# EAGLE board electrosteel2020_10_arrange2 (EAGLE 9.2.2), part 1 of 4
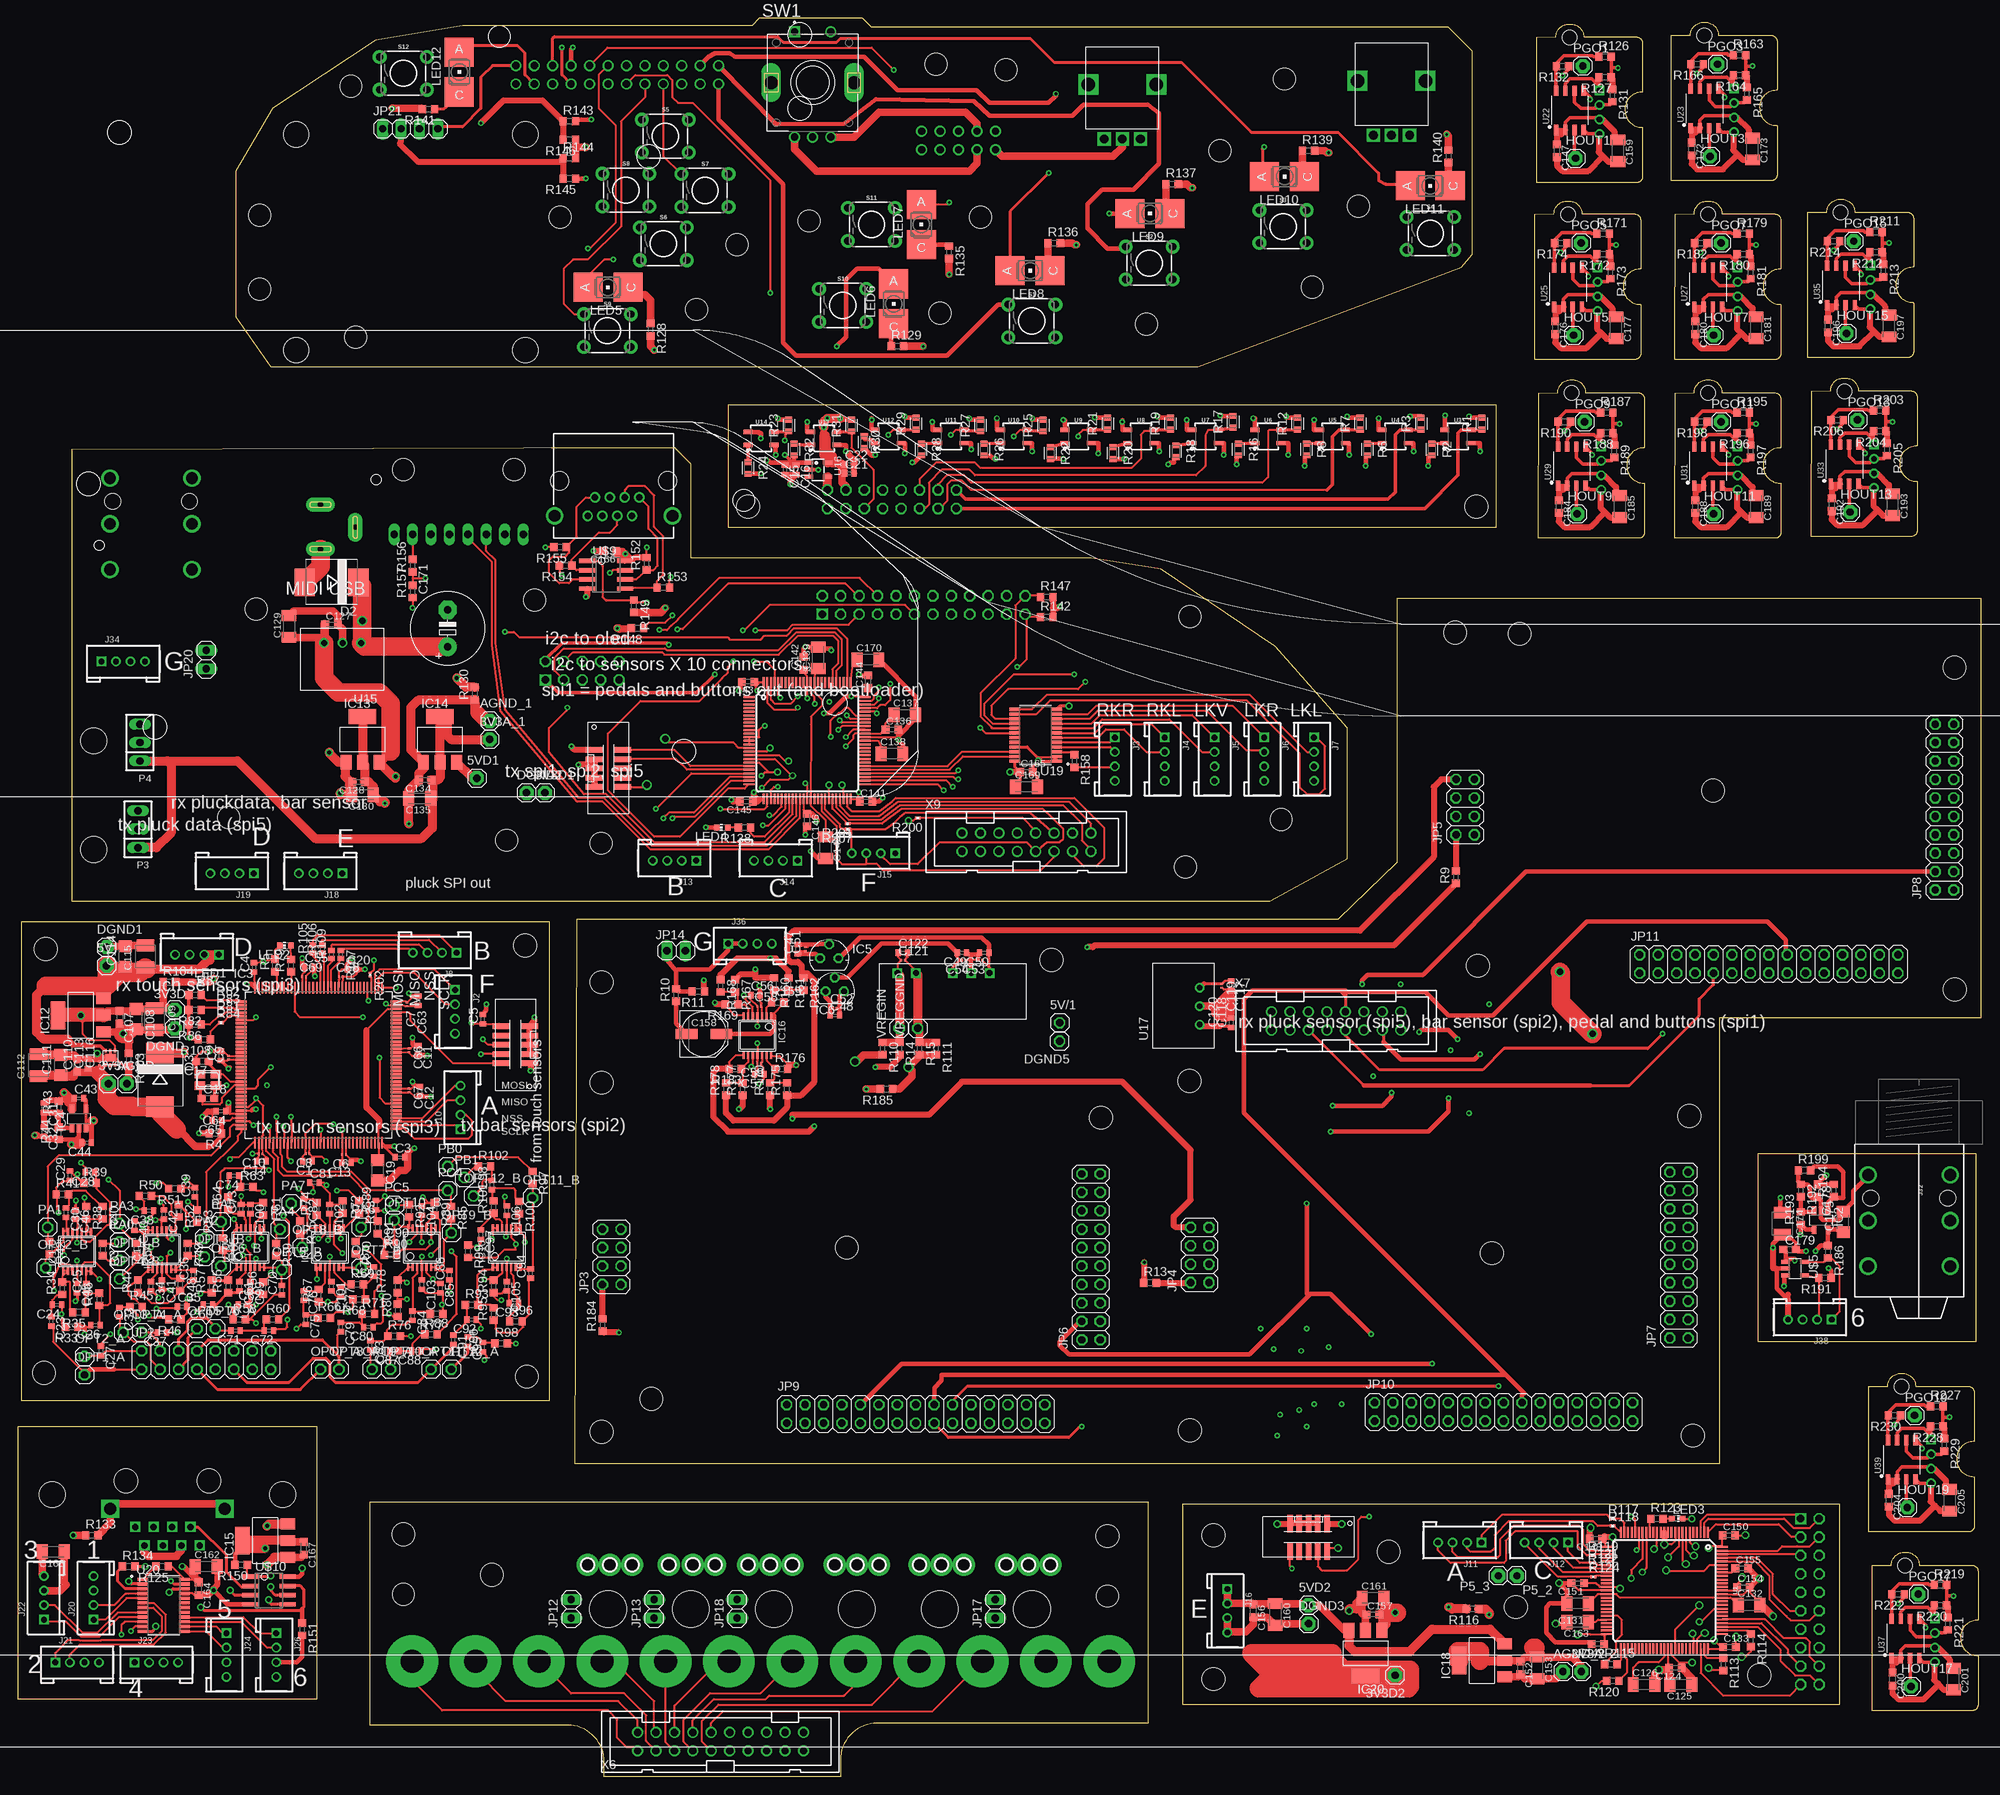
[diagram p7: board, top side]
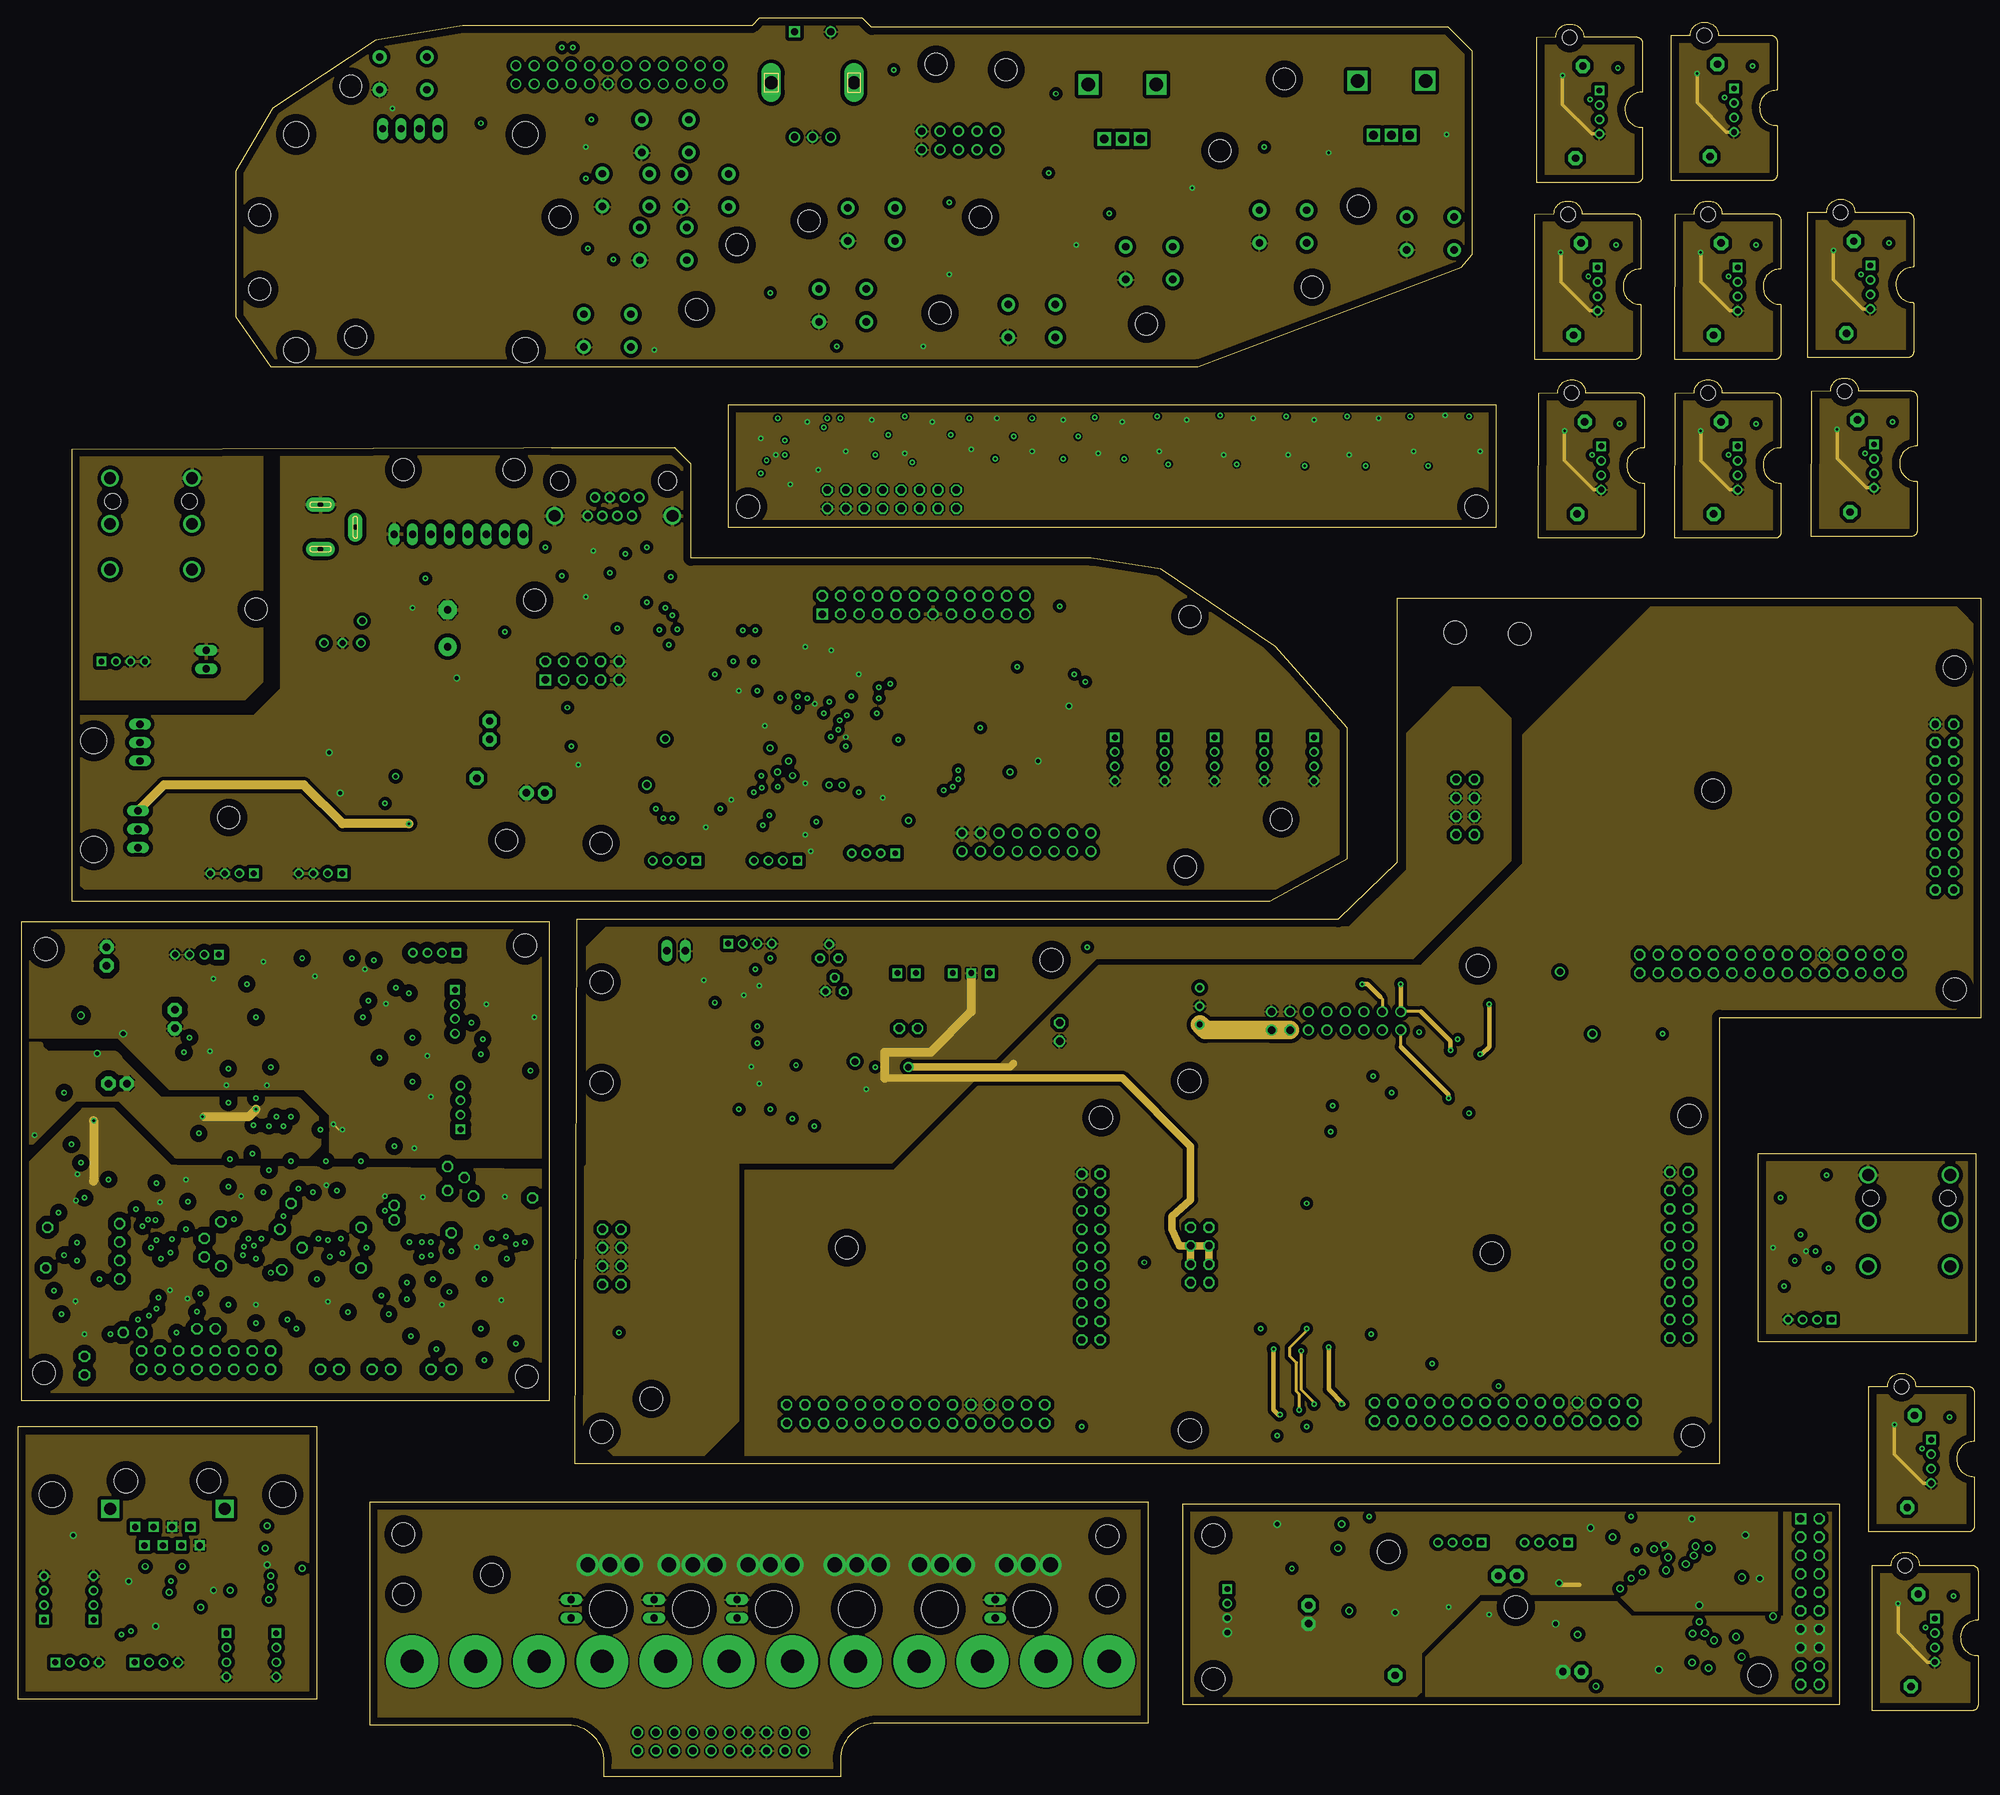
[diagram p8: board, inner layer Route2]
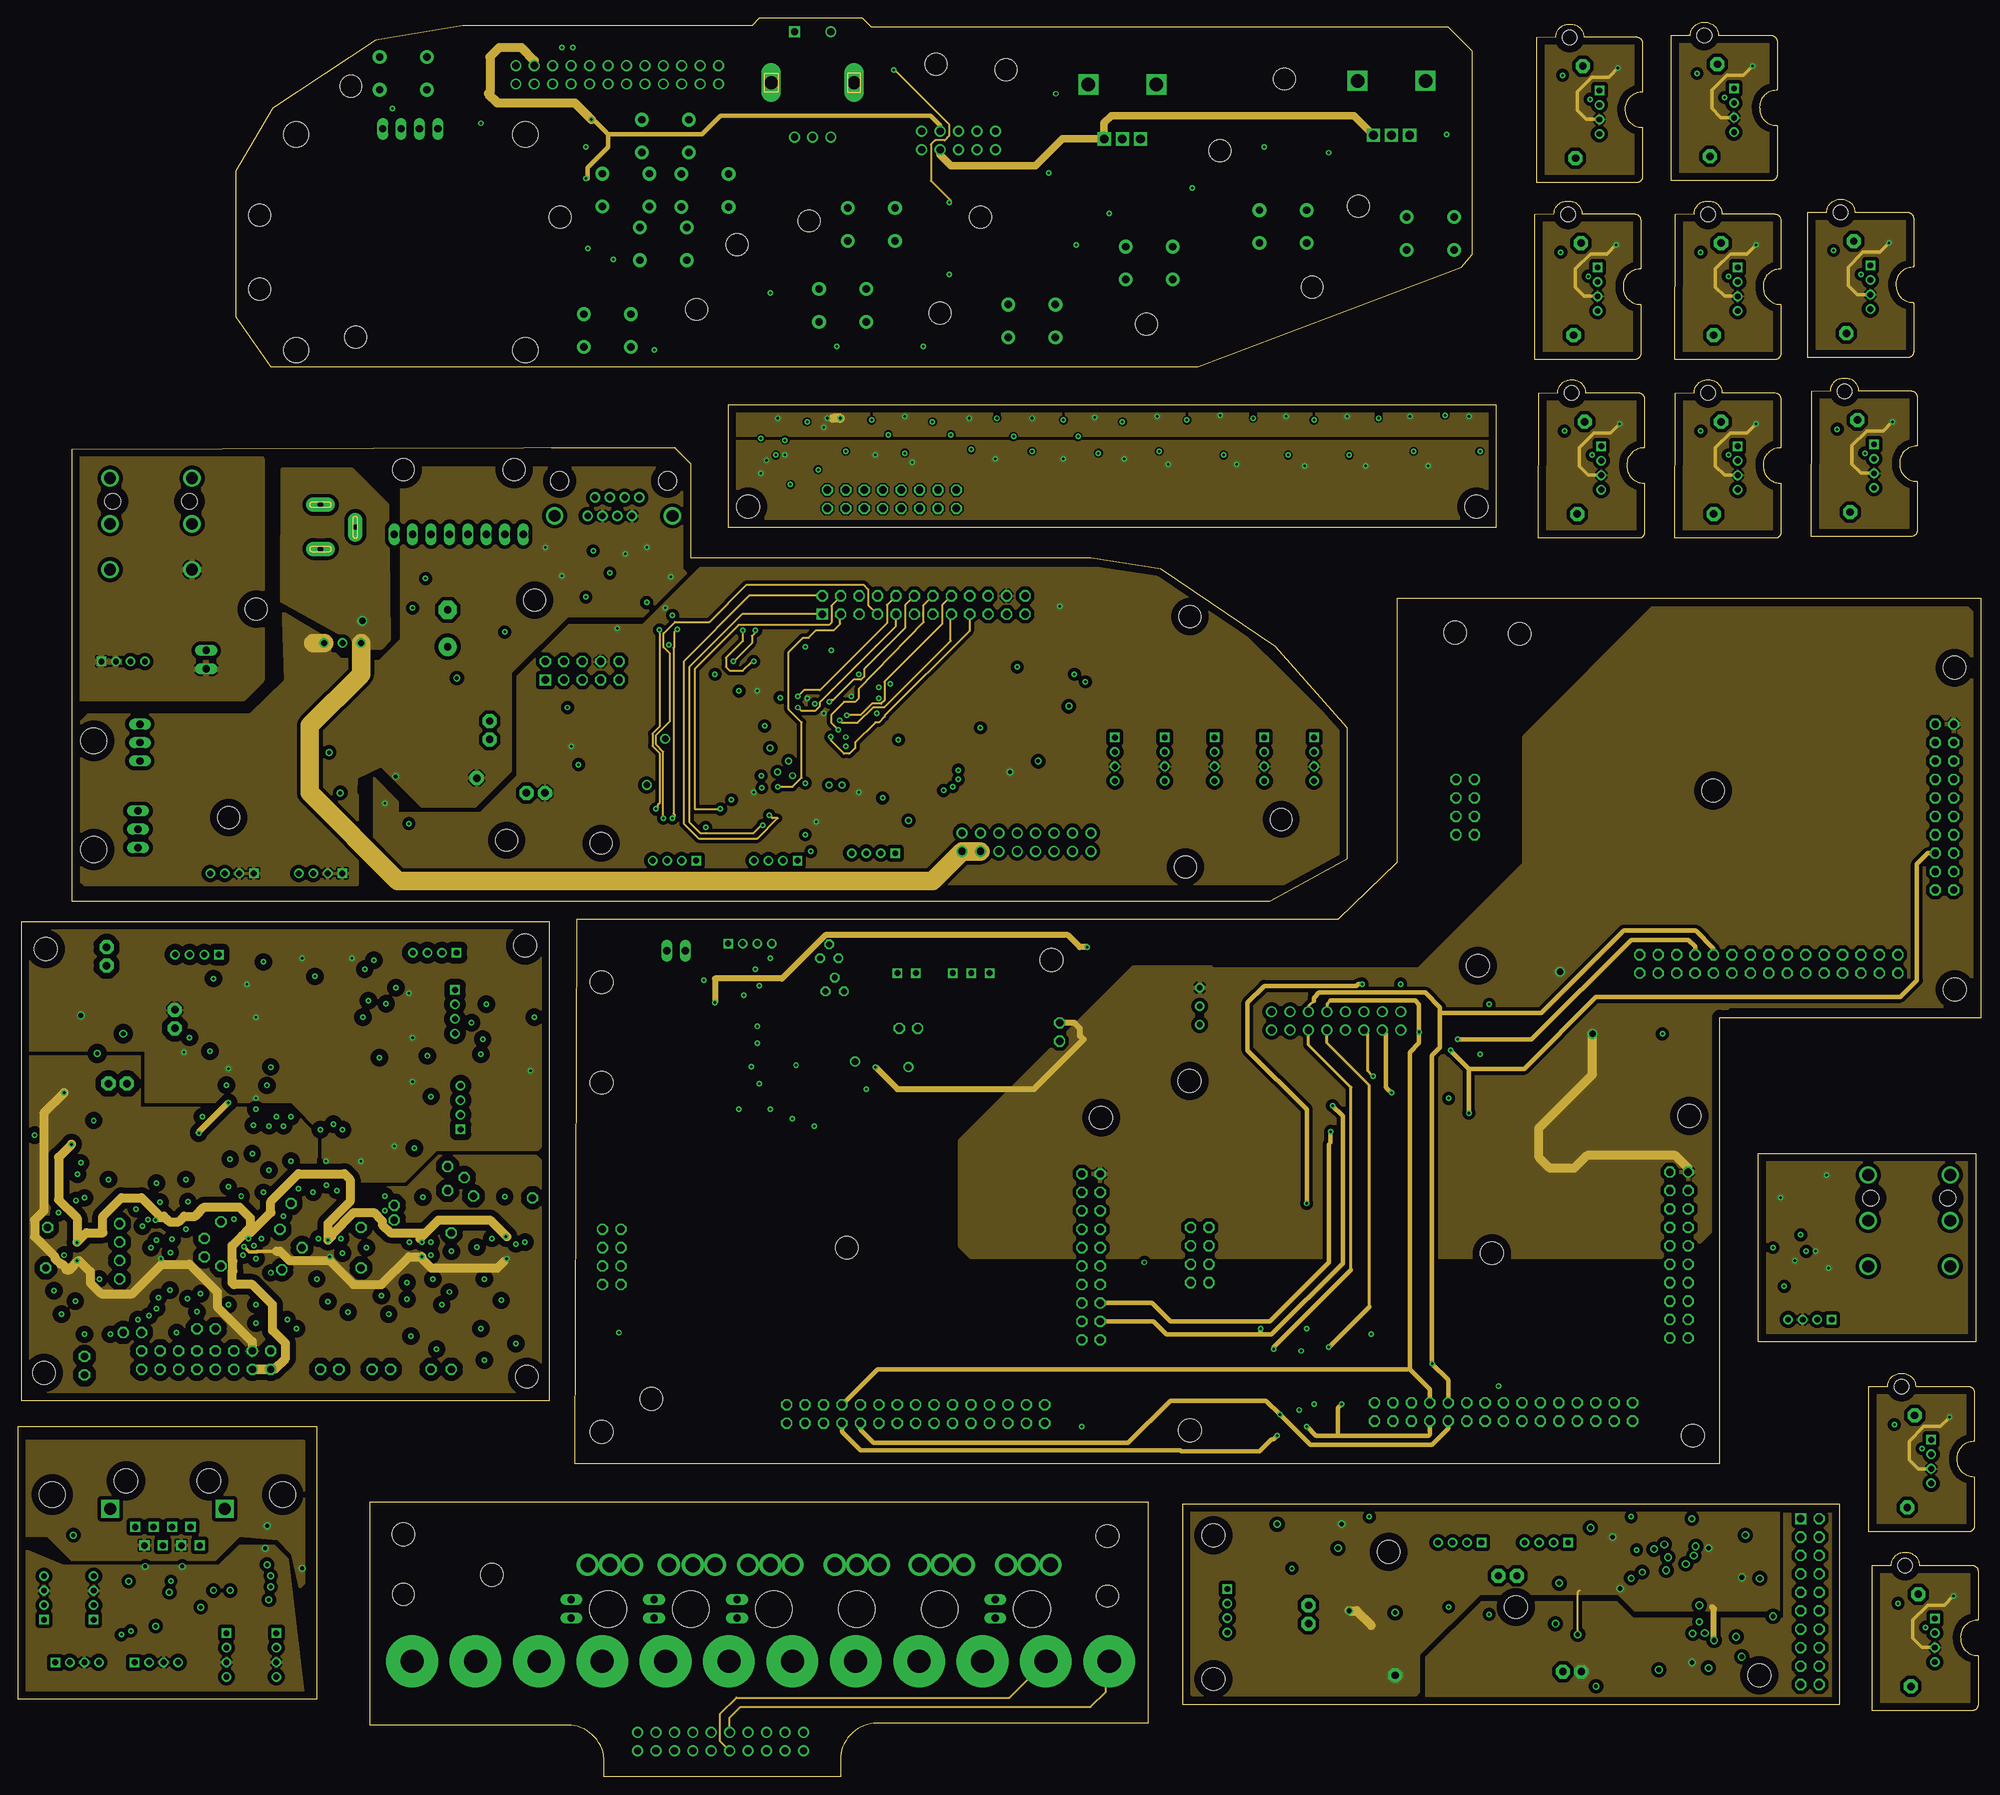
[diagram p9: board, inner layer Route15]
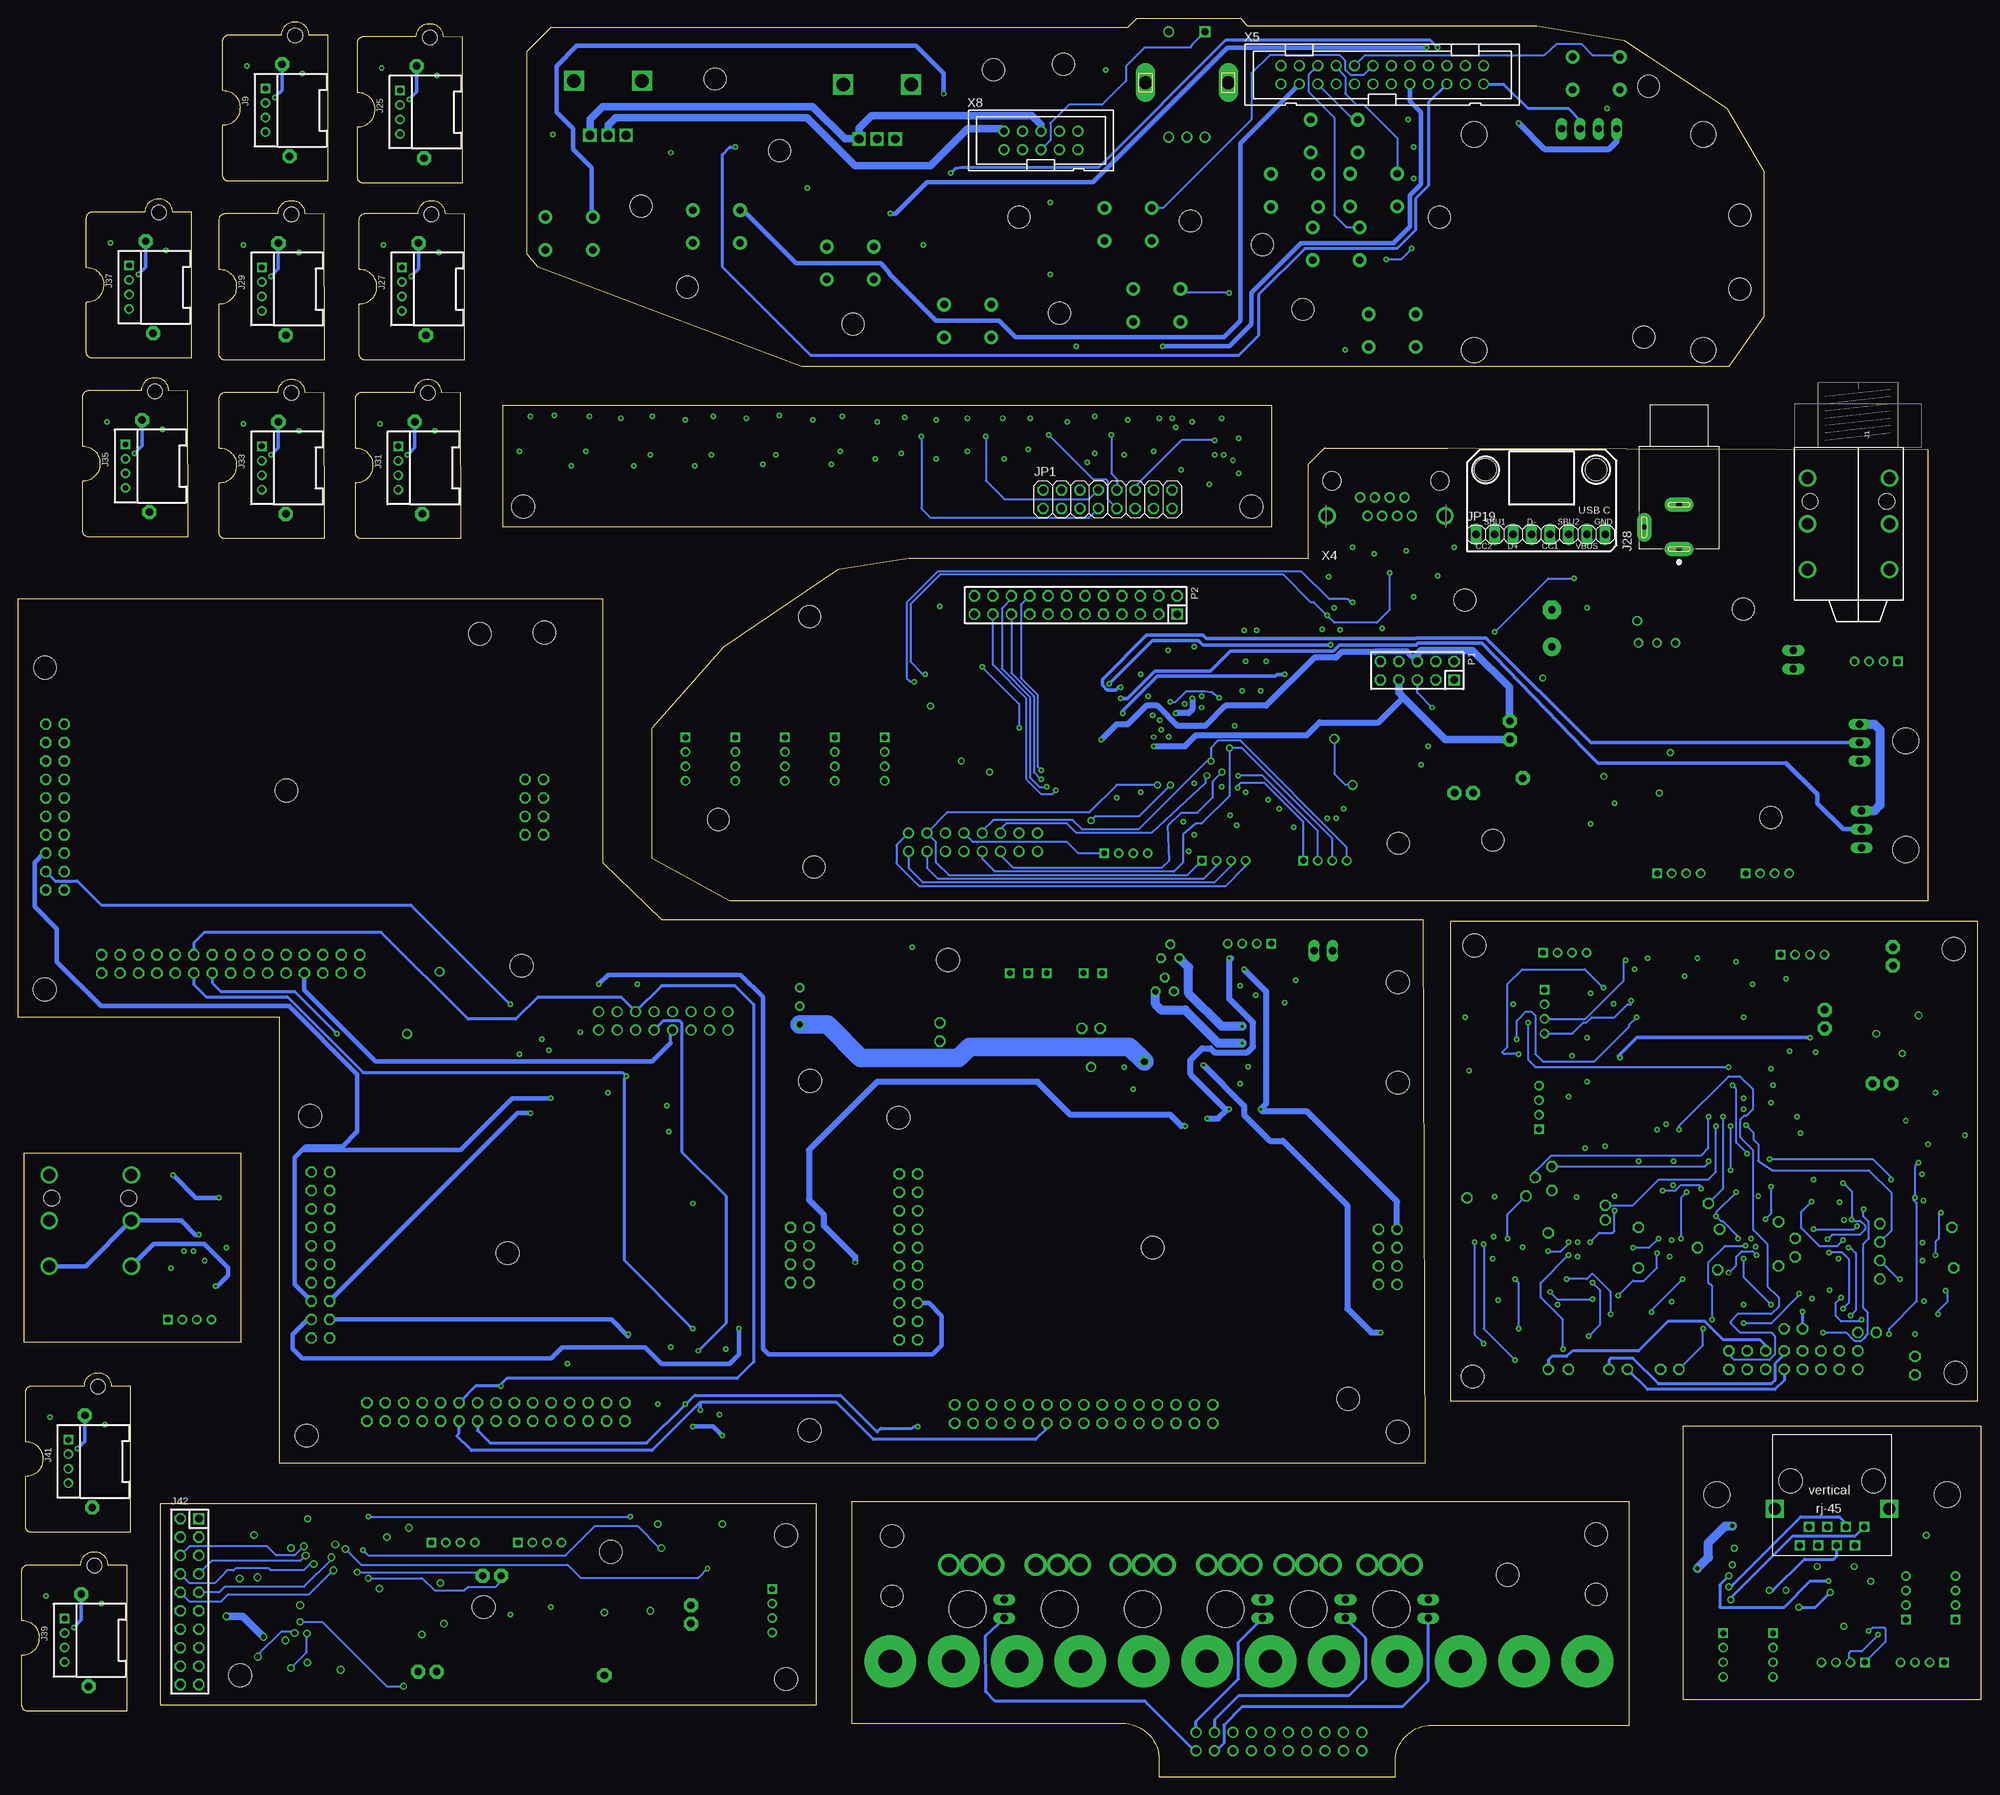
[diagram p10: board, bottom side, seen from below]

Size 270.51 x 242.32 mm. Coordinates in mm from the lower left corner, seen from the top.
Outline: 216 segments
Copper layers (1+2*15+16): Top 0.035mm / dielectric 0.5mm / Route2 0.035mm / dielectric 0.5mm / Route15 0.035mm / dielectric 0.5mm / Bottom 0.035mm
Design rules "default *": minimum track width 6mil, minimum drill 0.35mm, track to track 9mil, track to pad 9mil, pad to pad 9mil, via to via 9mil, smd to smd 9mil, copper to edge 40mil, drill to drill 6mil, minimum pad ring 10mil, minimum via ring 8mil, stop-mask expansion 4mil, vias tented up to drill 0mil, thermal gap 10mil
Holes 3.17 mm at 80.39,95.63 149.22,90.8 80.39,47.5 161.42,95.88 230.25,91.06 161.47,47.73 197.99,157.63 266.8,152.81 201.12,111.73 150.11,33.15 164.72,33.27 65.28,27.81 3.56,55.63 3.81,114.05 69.85,114.55 70.1,55.12 114.17,72.9 203.07,72.14 233.55,135.89 142.37,112.52 80.39,109.47 266.83,108.46 206.88,157.48 87.25,52.07 230.76,46.99 53.09,33.4 206.38,23.37 239.9,13.97 188.85,30.99 164.72,13.46 200.91,175.01 100.58,175.01
Holes 5.08 mm at 81.28,23.11 92.71,23.11 104.14,23.11 115.57,23.11 127,23.11 139.7,23.11
Holes 2.03 mm at 213.79,239.67 232.33,239.93 213.54,215.29 232.84,215.29 214.05,190.65 232.84,190.65 251.64,190.91 251.13,215.54 260.02,29.11 259.51,53.75
Holes 3.56 mm at 4.7,38.86 36.45,38.86 10.41,142.75 10.41,127.76
Holes 3.05 mm at 53.09,180.09 68.33,180.09 45.85,232.92 33.27,215.14 74.68,214.88 46.48,198.37 127,201.68 178.31,205.23 136.14,235.2 174.5,233.93 32.81,160.88 71.17,162.15 29,132.18 80.31,128.62 160.82,125.32 161.47,159.85 33.27,204.98 174.04,131.92 155.45,200.15 165.61,224.03 184.66,216.41 132.59,214.88 108.97,214.38 93.47,202.18 99.06,211.07 126.49,235.97 67.31,129.03 150.11,24.89 53.09,25.15
Holes 3.5 mm at 69.9,226.28 38.3,226.28 69.9,196.58 38.3,196.58

## Footprints (pad centres in the part's own frame; a part is rotated, then mirrored left to right if it is on the bottom)
1X01 = drill 1.016 pad 1.93 octagon: 1 0,0
1X01' = drill 1.016 octagon: 1 0,0
C0402 = smd 0.7 x 0.9: 1 -0.65,0; 2 0.65,0
C0201 = smd 0.25 x 0.35: 1 -0.25,0; 2 0.25,0
C0603 = smd 1.1 x 1: 1 -0.85,0; 2 0.85,0
C1206 = smd 1.6 x 1.8: 1 -1.4,0; 2 1.4,0
SMC_B = smd 1.6 x 2.4: + -1.5,0; - 1.5,0
C0603K = smd 1.05 x 1.08: 1 -0.875,0; 2 0.875,0
C1206K = smd 1.5 x 2: 1 -1.5,0; 2 1.5,0
PANASONIC_D = smd 3 x 1.4: + 2.4,0; - -2.4,0
E5-10,5 = drill 1.016 pad 2.54: + -2.54,0 | drill 1.016 pad 2.54 octagon: - 2.54,0
SMC = smd 2.8 x 3.8: A 3.7,0; C -3.7,0
TSSOP14 = smd 0.305 x 0.991: 1 -1.905,-2.718; 2 -1.27,-2.718; 3 -0.635,-2.718; 4 0,-2.718; 5 0.635,-2.718; 6 1.27,-2.718; 7 1.905,-2.718; 8 1.905,2.718; 9 1.27,2.718; 10 0.635,2.718; 11 0,2.718; 12 -0.635,2.718; 13 -1.27,2.718; 14 -1.905,2.718
SOT23-5 = smd 0.6 x 1.2: 1 -0.95,-1.306; 2 0,-1.306; 3 0.95,-1.306; 4 0.95,1.306; 5 -0.95,1.306
QFP50P2200X2200X160-144N = smd 1.56 x 0.28: 1 -10.68,8.75; 2 -10.68,8.25; 3 -10.68,7.75; 4 -10.68,7.25; 5 -10.68,6.75; 6 -10.68,6.25; 7 -10.68,5.75; 8 -10.68,5.25; 9 -10.68,4.75; 10 -10.68,4.25; 11 -10.68,3.75; 12 -10.68,3.25; 13 -10.68,2.75; 14 -10.68,2.25; 15 -10.68,1.75; 16 -10.68,1.25; 17 -10.68,0.75; 18 -10.68,0.25; 19 -10.68,-0.25; 20 -10.68,-0.75; 21 -10.68,-1.25; 22 -10.68,-1.75; 23 -10.68,-2.25; 24 -10.68,-2.75; 25 -10.68,-3.25; 26 -10.68,-3.75; 27 -10.68,-4.25; 28 -10.68,-4.75; 29 -10.68,-5.25; 30 -10.68,-5.75; 31 -10.68,-6.25; 32 -10.68,-6.75; 33 -10.68,-7.25; 34 -10.68,-7.75; 35 -10.68,-8.25; 36 -10.68,-8.75; 73 10.68,-8.75; 74 10.68,-8.25; 75 10.68,-7.75; 76 10.68,-7.25; 77 10.68,-6.75; 78 10.68,-6.25; 79 10.68,-5.75; 80 10.68,-5.25; 81 10.68,-4.75; 82 10.68,-4.25; 83 10.68,-3.75; 84 10.68,-3.25; 85 10.68,-2.75; 86 10.68,-2.25; 87 10.68,-1.75; 88 10.68,-1.25; 89 10.68,-0.75; 90 10.68,-0.25; 91 10.68,0.25; 92 10.68,0.75; 93 10.68,1.25; 94 10.68,1.75; 95 10.68,2.25; 96 10.68,2.75; 97 10.68,3.25; 98 10.68,3.75; 99 10.68,4.25; 100 10.68,4.75; 101 10.68,5.25; 102 10.68,5.75; 103 10.68,6.25; 104 10.68,6.75; 105 10.68,7.25; 106 10.68,7.75; 107 10.68,8.25; 108 10.68,8.75 | smd 0.28 x 1.56: 37 -8.75,-10.68; 38 -8.25,-10.68; 39 -7.75,-10.68; 40 -7.25,-10.68; 41 -6.75,-10.68; 42 -6.25,-10.68; 43 -5.75,-10.68; 44 -5.25,-10.68; 45 -4.75,-10.68; 46 -4.25,-10.68; 47 -3.75,-10.68; 48 -3.25,-10.68; 49 -2.75,-10.68; 50 -2.25,-10.68; 51 -1.75,-10.68; 52 -1.25,-10.68; 53 -0.75,-10.68; 54 -0.25,-10.68; 55 0.25,-10.68; 56 0.75,-10.68; 57 1.25,-10.68; 58 1.75,-10.68; 59 2.25,-10.68; 60 2.75,-10.68; 61 3.25,-10.68; 62 3.75,-10.68; 63 4.25,-10.68; 64 4.75,-10.68; 65 5.25,-10.68; 66 5.75,-10.68; 67 6.25,-10.68; 68 6.75,-10.68; 69 7.25,-10.68; 70 7.75,-10.68; 71 8.25,-10.68; 72 8.75,-10.68; 109 8.75,10.68; 110 8.25,10.68; 111 7.75,10.68; 112 7.25,10.68; 113 6.75,10.68; 114 6.25,10.68; 115 5.75,10.68; 116 5.25,10.68; 117 4.75,10.68; 118 4.25,10.68; 119 3.75,10.68; 120 3.25,10.68; 121 2.75,10.68; 122 2.25,10.68; 123 1.75,10.68; 124 1.25,10.68; 125 0.75,10.68; 126 0.25,10.68; 127 -0.25,10.68; 128 -0.75,10.68; 129 -1.25,10.68; 130 -1.75,10.68; 131 -2.25,10.68; 132 -2.75,10.68; 133 -3.25,10.68; 134 -3.75,10.68; 135 -4.25,10.68; 136 -4.75,10.68; 137 -5.25,10.68; 138 -5.75,10.68; 139 -6.25,10.68; 140 -6.75,10.68; 141 -7.25,10.68; 142 -7.75,10.68; 143 -8.25,10.68; 144 -8.75,10.68
78LXX = drill 0.813 octagon: GND 0,1.905; IN 1.27,0; OUT -1.27,0
79LXX = drill 0.813 octagon: GND -1.27,0; IN 0,1.905; OUT 1.27,0
6-WSON = smd 0.45 x 0.3: 1 -0.975,0.65; 2 -0.975,0; 3 -0.975,-0.65; 4 0.975,-0.65; 5 0.975,0; 6 0.975,0.65 | smd 0.9 x 1.6: PAD 0,0
SOT223 = smd 1.499 x 2.007: 1 -2.261,-3.15; 2 0.025,-3.15; 3 2.311,-3.15 | smd 3.81 x 2.007: PAD 0,3.15
AUDIO_JACK_0.25"_TRS_PTH_RA = drill 1.6: RING 10.5,-6.95; RING-NORM 10.5,4.35; SLEEVE 4.2,-6.95; SLEEVE-NORM 4.2,4.35; TIP 16.8,-6.95; TIP-NORM 16.8,4.35 | hole 2.2: 7.4,4; 7.4,-6.6
HW4-2.0 = drill 0.8 pad 1.27 square: 1 -3,0 | drill 0.8 pad 1.27: 2 -1,0; 3 1,0; 4 3,0
HW4-2.0-90D = drill 0.8 pad 1.27 square: 1 -3,0 | drill 0.8 pad 1.27: 2 -1,0; 3 1,0; 4 3,0
CUI_PJ-066A = drill 0.7 pad 2 long: 1 0,0; 2 6.1,0; 3 3,4.8
DIL-100-2X10_M = drill 1.016 square: 1 -11.43,1.27 | drill 1.016 octagon: 2 -11.43,-1.27; 3 -8.89,1.27; 4 -8.89,-1.27; 5 -6.35,1.27; 6 -6.35,-1.27; 7 -3.81,1.27; 8 -3.81,-1.27; 9 -1.27,1.27; 10 -1.27,-1.27; 11 1.27,1.27; 12 1.27,-1.27; 13 3.81,1.27; 14 3.81,-1.27; 15 6.35,1.27; 16 6.35,-1.27; 17 8.89,1.27; 18 8.89,-1.27; 19 11.43,1.27; 20 11.43,-1.27
2X08 = drill 1.016 octagon: 1 -8.89,-1.27; 2 -8.89,1.27; 3 -6.35,-1.27; 4 -6.35,1.27; 5 -3.81,-1.27; 6 -3.81,1.27; 7 -1.27,-1.27; 8 -1.27,1.27; 9 1.27,-1.27; 10 1.27,1.27; 11 3.81,-1.27; 12 3.81,1.27; 13 6.35,-1.27; 14 6.35,1.27; 15 8.89,-1.27; 16 8.89,1.27
2X04 = drill 1.016 octagon: 1 -3.81,-1.27; 2 -3.81,1.27; 3 -1.27,-1.27; 4 -1.27,1.27; 5 1.27,-1.27; 6 1.27,1.27; 7 3.81,-1.27; 8 3.81,1.27
2X10 = drill 1.016 octagon: 1 -11.43,-1.27; 2 -11.43,1.27; 3 -8.89,-1.27; 4 -8.89,1.27; 5 -6.35,-1.27; 6 -6.35,1.27; 7 -3.81,-1.27; 8 -3.81,1.27; 9 -1.27,-1.27; 10 -1.27,1.27; 11 1.27,-1.27; 12 1.27,1.27; 13 3.81,-1.27; 14 3.81,1.27; 15 6.35,-1.27; 16 6.35,1.27; 17 8.89,-1.27; 18 8.89,1.27; 19 11.43,-1.27; 20 11.43,1.27
2X15 = drill 1.016 octagon: 1 -17.78,-1.27; 2 -17.78,1.27; 3 -15.24,-1.27; 4 -15.24,1.27; 5 -12.7,-1.27; 6 -12.7,1.27; 7 -10.16,-1.27; 8 -10.16,1.27; 9 -7.62,-1.27; 10 -7.62,1.27; 11 -5.08,-1.27; 12 -5.08,1.27; 13 -2.54,-1.27; 14 -2.54,1.27; 15 0,-1.27; 16 0,1.27; 17 2.54,-1.27; 18 2.54,1.27; 19 5.08,-1.27; 20 5.08,1.27; 21 7.62,-1.27; 22 7.62,1.27; 23 10.16,-1.27; 24 10.16,1.27; 25 12.7,-1.27; 26 12.7,1.27; 27 15.24,-1.27; 28 15.24,1.27; 29 17.78,-1.27; 30 17.78,1.27
1X02 = drill 1.016 long: 1 -1.27,0; 2 1.27,0
1X08 = drill 1.016 long: 1 -8.89,0; 2 -6.35,0; 3 -3.81,0; 4 -1.27,0; 5 1.27,0; 6 3.81,0; 7 6.35,0; 8 8.89,0
1X04 = drill 1.016 long: 1 -3.81,0; 2 -1.27,0; 3 1.27,0; 4 3.81,0
CHIP-LED0603 = smd 0.8 x 0.8: A 0,-0.75; C 0,0.75
P-LCC-2 = smd 4 x 4: A 0,2.75; C 0,-2.75
DIL-100-2X05_M = drill 1.016 square: 1 -5.08,1.27 | drill 1.016 octagon: 2 -5.08,-1.27; 3 -2.54,1.27; 4 -2.54,-1.27; 5 0,1.27; 6 0,-1.27; 7 2.54,1.27; 8 2.54,-1.27; 9 5.08,1.27; 10 5.08,-1.27
DIL-100-2X12_M = drill 1.016 square: 1 -13.97,1.27 | drill 1.016 octagon: 2 -13.97,-1.27; 3 -11.43,1.27; 4 -11.43,-1.27; 5 -8.89,1.27; 6 -8.89,-1.27; 7 -6.35,1.27; 8 -6.35,-1.27; 9 -3.81,1.27; 10 -3.81,-1.27; 11 -1.27,1.27; 12 -1.27,-1.27; 13 1.27,1.27; 14 1.27,-1.27; 15 3.81,1.27; 16 3.81,-1.27; 17 6.35,1.27; 18 6.35,-1.27; 19 8.89,1.27; 20 8.89,-1.27; 21 11.43,1.27; 22 11.43,-1.27; 23 13.97,1.27; 24 13.97,-1.27
SIP-100-03-40Y = drill 1.016 long: 1 -2.54,0; 2 0,0; 3 2.54,0
NX3225 = smd 1.4 x 1.2: 1 -1.1,-0.8; 2 1.1,-0.8; 3 1.1,0.8; 4 -1.1,0.8
RESC1608X60 = smd 0.799 x 0.974: 1 -0.815,0; 2 0.815,0
R0603 = smd 1 x 1.1: 1 -0.85,0; 2 0.85,0
R0201 = smd 0.28 x 0.43: 1 -0.255,0; 2 0.255,0
R0402 = smd 0.7 x 0.9: 1 -0.55,0; 2 0.55,0
TACTILE_SWITCH_PTH_6.0MM = drill 1.016 pad 1.88: 1 -3.251,2.261; 2 3.251,2.261; 3 -3.251,-2.261; 4 3.251,-2.261
PEC11R-4215F-S0024 = drill 1 square: 1 -2.5,7 | drill 1: 2 2.5,7; A -2.5,-7.5; B 2.5,-7.5; C 0,-7.5 | drill 1.8 long: P1 -5.7,0; P2 5.7,0
TQFP-100-14X14MM = smd 1.5 x 0.27: 1 -8,6; 2 -8,5.5; 3 -8,5; 4 -8,4.5; 5 -8,4; 6 -8,3.5; 7 -8,3; 8 -8,2.5; 9 -8,2; 10 -8,1.5; 11 -8,1; 12 -8,0.5; 13 -8,0; 14 -8,-0.5; 15 -8,-1; 16 -8,-1.5; 17 -8,-2; 18 -8,-2.5; 19 -8,-3; 20 -8,-3.5; 21 -8,-4; 22 -8,-4.5; 23 -8,-5; 24 -8,-5.5; 25 -8,-6; 51 8,-6; 52 8,-5.5; 53 8,-5; 54 8,-4.5; 55 8,-4; 56 8,-3.5; 57 8,-3; 58 8,-2.5; 59 8,-2; 60 8,-1.5; 61 8,-1; 62 8,-0.5; 63 8,0; 64 8,0.5; 65 8,1; 66 8,1.5; 67 8,2; 68 8,2.5; 69 8,3; 70 8,3.5; 71 8,4; 72 8,4.5; 73 8,5; 74 8,5.5; 75 8,6 | smd 0.27 x 1.5: 26 -6,-8; 27 -5.5,-8; 28 -5,-8; 29 -4.5,-8; 30 -4,-8; 31 -3.5,-8; 32 -3,-8; 33 -2.5,-8; 34 -2,-8; 35 -1.5,-8; 36 -1,-8; 37 -0.5,-8; 38 0,-8; 39 0.5,-8; 40 1,-8; 41 1.5,-8; 42 2,-8; 43 2.5,-8; 44 3,-8; 45 3.5,-8; 46 4,-8; 47 4.5,-8; 48 5,-8; 49 5.5,-8; 50 6,-8; 76 6,8; 77 5.5,8; 78 5,8; 79 4.5,8; 80 4,8; 81 3.5,8; 82 3,8; 83 2.5,8; 84 2,8; 85 1.5,8; 86 1,8; 87 0.5,8; 88 0,8; 89 -0.5,8; 90 -1,8; 91 -1.5,8; 92 -2,8; 93 -2.5,8; 94 -3,8; 95 -3.5,8; 96 -4,8; 97 -4.5,8; 98 -5,8; 99 -5.5,8; 100 -6,8
QRE1113 = smd 1.2 x 0.6: 1 -1.8,-0.9; 2 1.8,-0.9; 3 1.8,0.9; 4 -1.8,0.9
DC-DC_CONVERTER_78XX = drill 0.8: GND 0,0; VIN -2.54,0; VOUT 2.54,0
TEXAS_SOT23-5 = smd 0.55 x 1.2: 1 -0.95,-1.3; 2 0,-1.3; 3 0.95,-1.3; 4 0.95,1.3; 5 -0.95,1.3
SOP65P640X120-24N = smd 1.57 x 0.41: 1 -2.87,3.575; 2 -2.87,2.925; 3 -2.87,2.275; 4 -2.87,1.625; 5 -2.87,0.975; 6 -2.87,0.325; 7 -2.87,-0.325; 8 -2.87,-0.975; 9 -2.87,-1.625; 10 -2.87,-2.275; 11 -2.87,-2.925; 12 -2.87,-3.575; 13 2.87,-3.575; 14 2.87,-2.925; 15 2.87,-2.275; 16 2.87,-1.625; 17 2.87,-0.975; 18 2.87,-0.325; 19 2.87,0.325; 20 2.87,0.975; 21 2.87,1.625; 22 2.87,2.275; 23 2.87,2.925; 24 2.87,3.575
SOIC8-1.27-5X4MM = smd 0.6 x 1.4: 1 -1.905,-2.7; 2 -0.635,-2.7; 3 0.635,-2.7; 4 1.905,-2.7; 5 1.905,2.7; 6 0.635,2.7; 7 -0.635,2.7; 8 -1.905,2.7
RK09 = drill 1.2 square: 1-09 -2.5,-7.5; 2-09 0,-7.5; 3-09 2.5,-7.5 | drill 1.854 square: MOUNT1 -4.683,0; MOUNT2 4.683,0
CMR0512S3C = drill 0.8 square: P$1 -7.62,0; P$2 -5.08,0; P$3 0,0; P$4 2.54,0; P$5 5.08,0
SOT23-5L = smd 0.55 x 1.2: 1 -0.95,-1.3; 2 0,-1.3; 3 0.95,-1.3; 4 0.95,1.3; 5 -0.95,1.3
SS-7188VS-A-FLS_RJ45 = drill 0.889 square: P$1 -4.445,4.445; P$2 -3.175,6.985; P$3 -1.905,4.445; P$4 -0.635,6.985; P$5 0.635,4.445; P$6 1.905,6.985; P$7 3.175,4.445; P$8 4.445,6.985 | drill 1.651 square: P$9 -7.874,1.981; P$10 7.874,1.981 | hole 3.277: -5.715,-1.905; 5.715,-1.905
SO8 = smd 0.6 x 2.2: 1 -1.905,-2.6; 2 -0.635,-2.6; 3 0.635,-2.6; 4 1.905,-2.6; 5 1.905,2.6; 6 0.635,2.6; 7 -0.635,2.6; 8 -1.905,2.6
3221-10-0300-00 = smd 0.76 x 2.4: 1 -2.54,-1.87; 2 -2.54,1.97; 3 -1.27,-1.87; 4 -1.27,1.97; 5 0,-1.87; 6 0,1.97; 7 1.27,-1.87; 8 1.27,1.97; 9 2.54,-1.87; 10 2.54,1.97
GLX-S-88M = drill 0.9 pad 1.422: 1 -3.57,-2.3; 2 -2.55,-4.84; 3 -1.53,-2.3; 4 -0.51,-4.84; 5 0.51,-2.3; 6 1.53,-4.84; 7 2.55,-2.3; 8 3.57,-4.84 | drill 1.6 pad 2.184: S1 -8.125,-4.84; S2 8.125,-4.84 | hole 2.55: -7.44,0; 7.44,0
PAK100/2500-24 = drill 1 pad 1.422: 1 -13.97,-1.27; 2 -13.97,1.27; 3 -11.43,-1.27; 4 -11.43,1.27; 5 -8.89,-1.27; 6 -8.89,1.27; 7 -6.35,-1.27; 8 -6.35,1.27; 9 -3.81,-1.27; 10 -3.81,1.27; 11 -1.27,-1.27; 12 -1.27,1.27; 13 1.27,-1.27; 14 1.27,1.27; 15 3.81,-1.27; 16 3.81,1.27; 17 6.35,-1.27; 18 6.35,1.27; 19 8.89,-1.27; 20 8.89,1.27; 21 11.43,-1.27; 22 11.43,1.27; 23 13.97,-1.27; 24 13.97,1.27
PAK100/2500-20 = drill 1 pad 1.422: 1 -11.43,-1.27; 2 -11.43,1.27; 3 -8.89,-1.27; 4 -8.89,1.27; 5 -6.35,-1.27; 6 -6.35,1.27; 7 -3.81,-1.27; 8 -3.81,1.27; 9 -1.27,-1.27; 10 -1.27,1.27; 11 1.27,-1.27; 12 1.27,1.27; 13 3.81,-1.27; 14 3.81,1.27; 15 6.35,-1.27; 16 6.35,1.27; 17 8.89,-1.27; 18 8.89,1.27; 19 11.43,-1.27; 20 11.43,1.27
PAK100/2500-16 = drill 1 pad 1.422: 1 -8.89,-1.27; 2 -8.89,1.27; 3 -6.35,-1.27; 4 -6.35,1.27; 5 -3.81,-1.27; 6 -3.81,1.27; 7 -1.27,-1.27; 8 -1.27,1.27; 9 1.27,-1.27; 10 1.27,1.27; 11 3.81,-1.27; 12 3.81,1.27; 13 6.35,-1.27; 14 6.35,1.27; 15 8.89,-1.27; 16 8.89,1.27
PAK100/2500-10 = drill 1 pad 1.422: 1 -5.08,-1.27; 2 -5.08,1.27; 3 -2.54,-1.27; 4 -2.54,1.27; 5 0,-1.27; 6 0,1.27; 7 2.54,-1.27; 8 2.54,1.27; 9 5.08,-1.27; 10 5.08,1.27

## Placement (x,y rotation side)
3V3A  [1X01]  12.45,95.5 0 top
3V3A_1  [1X01]  64.96,142.93 0 top
3V3A_2  [1X01]  215.39,14.48 0 top
3V3D  [1X01]  21.59,105.66 0 top
3V3D1  [1X01]  72.58,135.56 0 top
3V3D2  [1X01]  189.74,13.97 180 top
5V  [1X01]  12.19,111.76 0 top
5V/1  PINHD-1X1  [1X01']  143.51,103.89 0 top
5VD1  [1X01]  63.19,137.59 0 top
5VD2  [1X01]  177.8,23.62 0 top
AGND  [1X01]  14.99,95.5 0 top
AGND_1  [1X01]  64.96,145.47 0 top
AGND_2  [1X01]  212.85,14.48 0 top
C1  .1uf  [C0402]  39.88,84.84 180 top
C2  .1uf  [C0402]  27.94,99.31 90 top
C3  .1uf  [C0402]  52.58,85.34 0 top
C4  .1uf  [C0402]  32.51,111.51 90 top
C5  .1uf  [C0402]  64.01,104.39 90 top
C6  .01uf  [C0201]  44.91,85.72 180 top
C7  .01uf  [C0201]  53.59,106.43 270 top
C8  .01uf  [C0201]  39.88,85.85 180 top
C9  .01uf  [C0201]  28.96,99.06 90 top
C10  .01uf  [C0201]  33.4,85.88 180 top
C11  .1uf  [C0402]  55.12,100.08 270 top
C12  .1uf  [C0402]  55.37,94.49 270 top
C13  .1uf  [C0402]  45.21,84.58 180 top
C14  .1uf  [C0402]  33.53,84.84 180 top
C15  .1uf  [C0402]  105.66,180.09 270 top
C16  .01uf  [C0402]  107.19,180.09 270 top
C17  18pf  [C0603]  25.4,98.55 180 top
C18  18pf  [C0603]  26.16,93.47 0 top
C19  2.2uf  [C1206]  49.53,83.57 270 top
C20  .1uf  [C0402]  45.97,111.25 0 top
C21  .01uf  [C0402]  114.55,179.58 0 top
C22  .1uf  [C0402]  114.55,180.85 0 top
C23  .1uf  [C0402]  4.57,62.74 270 top
C24  .1uf  [C0402]  5.33,65.02 180 top
C25  .1uf  [C0402]  9.4,67.31 90 top
C26  .1uf  [C0402]  10.67,62.23 180 top
C27  .1uf  [C0402]  11.43,58.67 270 top
C28  .1uf  [C0402]  9.91,83.31 180 top
C29  .1uf  [C0402]  7.11,82.8 90 top
C30  .1uf  [C0402]  6.6,77.72 270 top
C31  .1uf  [C0402]  3.56,92.2 270 top
C32  .1uf  [C0402]  3.56,88.9 270 top
C33  .1uf  [C0402]  13.97,64.01 270 top
C34  .1uf  [C0402]  18.29,67.56 270 top
C35  .1uf  [C0402]  22.61,64.77 0 top
C36  .1uf  [C0402]  24.13,69.09 90 top
C37  .1uf  [C0402]  19.81,61.21 180 top
C38  .1uf  [C0402]  18.03,77.98 180 top
C39  .1uf  [C0402]  24.38,80.52 90 top
C40  .1uf  [C0402]  16,75.95 270 top
C41  .1uf  [C0402]  19.81,67.82 270 top
C42  .1uf  [C0402]  20.07,77.47 270 top
C43  .1uf  [C0402]  8.38,93.47 0 top
C44  .1uf  [C0402]  9.4,87.38 180 top
C45  .1uf  [C0402]  8.13,67.31 270 top
C46  .1uf  [C0402]  7.87,77.47 270 top
C47  .1uf  [C0402]  107.44,114.05 90 top
C48  .1uf  [C0402]  112.52,104.9 0 top
C49  .1uf  [C0402]  130.05,113.54 180 top
C50  .1uf  [C0402]  133.1,113.54 180 top
C51  .01uf  [C0201]  108.46,114.05 90 top
C52  .01uf  [C0201]  112.52,105.92 0 top
C53  .01uf  [C0201]  132.59,112.52 180 top
C54  .01uf  [C0201]  130.3,112.52 180 top
C55  .1uf  [C0402]  40.13,111.56 0 top
C56  .1uf  [C0402]  101.6,107.7 0 top
C57  .1uf  [C0402]  102.11,96.77 180 top
C58  .01uf  [C0201]  102.11,106.17 0 top
C59  .01uf  [C0201]  102.11,98.3 180 top
C60  .1uf  [C0402]  26.16,65.02 180 top
C61  .1uf  [C0402]  30.48,67.56 270 top
C62  .1uf  [C0402]  30.99,65.02 0 top
C63  .1uf  [C0402]  55.12,106.93 270 top
C64  .01uf  [C0402]  27.94,91.69 180 top
C65  .01uf  [C0402]  27.41,90.42 180 top
C66  .01uf  [C0201]  53.85,100.08 270 top
C67  .01uf  [C0201]  53.87,94.56 270 top
C68  .01uf  [C0201]  44.45,110.24 0 top
C69  .01uf  [C0201]  39.4,110.24 0 top
C70  .1uf  [C0402]  36.32,67.06 90 top
C71  .1uf  [C0402]  29.97,61.47 180 top
C72  .1uf  [C0402]  34.54,61.47 180 top
C73  .1uf  [C0402]  30.73,78.23 90 top
C74  .1uf  [C0402]  29.72,82.8 180 top
C75  .1uf  [C0402]  39.62,62.99 270 top
C76  .1uf  [C0402]  39.37,66.29 270 top
C77  .1uf  [C0402]  44.45,66.8 270 top
C78  .1uf  [C0402]  49.02,69.6 90 top
C79  .1uf  [C0402]  44.45,61.98 270 top
C80  .1uf  [C0402]  48.26,61.98 180 top
C81  .1uf  [C0402]  40.82,81.84 0 top
C82  .1uf  [C0402]  39.37,78.99 270 top
C83  .1uf  [C0402]  48.51,59.44 270 top
C84  .1uf  [C0402]  54.36,63.5 270 top
C85  .1uf  [C0402]  58.17,67.31 270 top
C86  .1uf  [C0402]  59.44,69.09 90 top
C87  .1uf  [C0402]  51.82,58.67 180 top
C88  .1uf  [C0402]  54.86,58.67 180 top
C89  .1uf  [C0402]  49.28,78.74 90 top
C90  .1uf  [C0402]  51.31,73.66 0 top
C91  .1uf  [C0402]  59.94,60.2 270 top
C92  .1uf  [C0402]  62.48,62.99 180 top
C93  .1uf  [C0402]  68.33,65.28 180 top
C94  .1uf  [C0402]  70.61,69.34 90 top
C95  .1uf  [C0402]  61.98,59.94 270 top
C96  .1uf  [C0402]  64.01,59.18 90 top
C97  .1uf  [C0402]  63.75,74.68 270 top
C98  .1uf  [C0402]  65.28,81.53 90 top
C99  .1uf  [C0402]  32,67.56 270 top
C100  .1uf  [C0402]  32,78.23 270 top
C101  .1uf  [C0402]  43.18,67.56 270 top
C102  .1uf  [C0402]  42.93,78.23 270 top
C103  .1uf  [C0402]  55.63,67.82 270 top
C104  .1uf  [C0402]  55.63,77.98 270 top
C105  .1uf  [C0402]  67.31,67.56 270 top
C106  .1uf  [C0402]  67.31,77.98 270 top
C107  .1uf  [C0603]  13.97,104.65 270 top
C108  1uf  [C1206]  16.26,104.39 270 top
C109  10uf  [SMC_B]  18.8,104.39 270 top
C110  .1uf  [C0603]  8.13,98.04 90 top
C111  1uf  [C1206]  5.84,98.04 90 top
C112  10uf  [SMC_B]  2.79,98.04 90 top
C113  .1uf  [C0402]  9.65,98.24 90 top
C114  1uf  [C1206]  14.73,113.03 90 top
C115  10uf  [SMC_B]  17.53,113.03 90 top
C116  .01uf  [C0201]  11.18,98.3 90 top
C117  .1uf  [C0402]  167.13,108.97 270 top
C118  .1uf  [C0402]  167.13,103.89 90 top
C119  .01uf  [C0201]  165.86,108.97 270 top
C120  .01uf  [C0201]  165.89,103.94 90 top
C121  .01uf  [C0201]  121.92,112.52 0 top
C122  .1uf  [C0402]  121.92,113.54 0 top
C124  .1uf  [C0603K]  228.35,14.99 180 top
C125  1uf  [C1206K]  229.11,12.7 180 top
C126  1uf  [C1206K]  224.03,12.7 0 top
C127  .1uf  [C0603K]  43.18,158.75 0 top
C128  .1uf  [C0603K]  46.93,137.08 180 top
C129  10uf  [C1206K]  37.34,158.5 90 top
C130  10uf  [C1206K]  47.44,135.31 180 top
C131  1uf  [C1206K]  214.88,23.88 180 top
C132  1uf  [C1206K]  238.51,23.62 0 top
C133  .1uf  [C0603K]  235.8,17.87 0 top
C134  .1uf  [C0603K]  56.07,137.34 180 top
C135  10uf  [C1206K]  55.31,134.8 180 top
C136  .1uf  [C0603K]  120.4,144.27 0 top
C137  1uf  [C1206K]  122.17,146.3 0 top
C138  1uf  [C1206K]  120.4,140.97 0 top
C139  1uf  [C1206K]  110.24,154.18 90 top
C140  1uf  [C1206K]  111.25,128.02 270 top
C141  .1uf  [C0603K]  116.84,134.37 0 top
C142  .1uf  [C0603K]  108.2,153.42 90 top
C143  .1uf  [C0603K]  100.58,150.88 180 top
C144  .1uf  [C0603K]  117.09,150.88 90 top
C145  .1uf  [C0603K]  100.33,134.37 180 top
C146  .1uf  [C0603K]  108.71,131.83 270 top
C147  .1uf  [C0603K]  212.04,224.03 270 top
C148  .1uf  [C0603K]  217.41,32.79 180 top
C149  .1uf  [C0603K]  217.68,18.29 180 top
C150  .1uf  [C0603K]  235.71,33.27 0 top
C151  .1uf  [C0603K]  214.88,26.67 180 top
C152  .1uf  [C0603K]  207.01,14.99 270 top
C153  10uf  [C1206K]  209.3,14.99 270 top
C154  .1uf  [C0603K]  237.72,26.11 0 top
C155  2200pf  [C0603K]  237.49,28.7 0 top
C156  .1uf  [C0603K]  170.18,22.86 270 top
C157  .1uf  [C0603K]  186.69,22.35 0 top
C158  22uf  [PANASONIC_D]  94.49,102.36 0 top
C159  1uf  [C1206K]  220.42,224.03 270 top
C160  10uf  [C1206K]  173.23,22.35 270 top
C161  10uf  [C1206K]  186.69,24.64 0 top
C162  1uf  [C1206K]  25.91,28.96 0 top
C163  1uf  [C1206K]  214.88,21.34 180 top
C164  .1uf  [C0603K]  24.89,25.91 270 top
C165  .1uf  [C0603K]  138.94,138.43 0 top
C166  .1uf  [C0603K]  81.53,168.91 180 top
C167  .1uf  [C0603K]  39.37,31.5 270 top
C168  10uf  [C1206K]  4.83,30.99 180 top
C169  1uf  [C1206K]  138.94,136.4 0 top
C170  1uf  [C1206K]  117.09,153.92 0 top
C171  [E5-10,5]  59.18,158.24 90 top
C172  .1uf  [C0603K]  230.58,224.28 270 top
C173  1uf  [C1206K]  238.96,224.28 270 top
C174  10uf  [SMC_B]  243.08,76.2 270 top
C175  1uf  [C1206]  251.46,76.45 90 top
C176  .1uf  [C0603K]  211.79,199.64 270 top
C177  1uf  [C1206K]  220.17,199.64 270 top
C178  .1uf  [C0603]  247.9,80.77 270 top
C179  .1uf  [C0603]  244.09,72.64 0 top
C180  .1uf  [C0603K]  231.09,199.64 270 top
C181  1uf  [C1206K]  239.47,199.64 270 top
C184  .1uf  [C0603K]  212.29,175.01 270 top
C185  1uf  [C1206K]  220.68,175.01 270 top
C188  .1uf  [C0603K]  231.09,175.01 270 top
C189  1uf  [C1206K]  239.47,175.01 270 top
C192  .1uf  [C0603K]  249.89,175.26 270 top
C193  1uf  [C1206K]  258.27,175.26 270 top
C196  .1uf  [C0603K]  249.38,199.9 270 top
C197  1uf  [C1206K]  257.76,199.9 270 top
C200  .1uf  [C0603K]  258.27,13.46 270 top
C201  1uf  [C1206K]  266.65,13.46 270 top
C204  .1uf  [C0603K]  257.76,38.1 270 top
C205  1uf  [C1206K]  266.14,38.1 270 top
D2  MBRS340T3  [SMC]  43.18,164.59 180 top
D3  MBRS340T3  [SMC]  19.56,96.01 270 top
DGND  [1X01]  21.59,103.12 180 top
DGND1  [1X01]  12.19,114.3 0 top
DGND2  [1X01]  70.04,135.56 0 top
DGND3  [1X01]  177.8,21.08 0 top
DGND5  PINHD-1X1  [1X01']  143.51,101.35 180 top
HOUT1  [1X01]  214.58,223.01 0 top
HOUT3  [1X01]  233.12,223.27 0 top
HOUT5  [1X01]  214.33,198.63 0 top
HOUT7  [1X01]  233.63,198.63 0 top
HOUT9  [1X01]  214.83,173.99 0 top
HOUT11  [1X01]  233.63,173.99 0 top
HOUT13  [1X01]  252.43,174.24 0 top
HOUT15  [1X01]  251.92,198.88 0 top
HOUT17  [1X01]  260.81,12.45 0 top
HOUT19  [1X01]  260.3,37.08 0 top
IC1  OPA4344E  [TSSOP14]  19.81,72.64 0 top
IC2  LMV321M5  [SOT23-5]  248.41,76.71 180 top
IC3  STM32H743ZIT6  [QFP50P2200X2200X160-144N]  41.4,98.04 0 top
IC4  LMV321M5  [SOT23-5]  8.38,90.68 0 top
IC5  [78LXX]  111.76,112.78 0 top
IC6  [79LXX]  112.52,108.2 0 top
IC7  OPA4344E  [TSSOP14]  32,72.9 0 top
IC8  OPA4344E  [TSSOP14]  42.93,72.9 0 top
IC9  OPA4344E  [TSSOP14]  55.63,72.9 0 top
IC10  OPA4344E  [TSSOP14]  67.31,72.9 0 top
IC11  LP5912  [6-WSON]  12.7,99.06 90 top
IC12  REG1117  [SOT223]  8.64,104.9 90 top
IC13  REG1117  [SOT223]  47.44,142.93 0 top
IC14  REG1117  [SOT223]  58.11,142.93 0 top
IC15  REG1117  [SOT223]  34.04,32.51 90 top
IC16  OPA4344E  [TSSOP14]  101.85,102.11 180 top
IC17  OPA4344E  [TSSOP14]  8.13,72.39 0 top
IC18  REG1117  [SOT223]  201.68,16 90 top
IC20  REG1117  [SOT223]  185.67,17.02 180 top
J1  AUDIO_JACK_TRS_0.25"_PTH_RA  [AUDIO_JACK_0.25"_TRS_PTH_RA]  17.02,183.13 270 bottom
J2  4P-2.0  [HW4-2.0]  60.2,105.41 270 top
J3  4P-2.0  [HW4-2.0]  151.13,140.21 270 top
J4  4P-2.0  [HW4-2.0]  157.99,140.21 270 top
J5  4P-2.0  [HW4-2.0]  164.85,140.21 270 top
J6  4P-2.0  [HW4-2.0]  171.7,140.21 270 top
J7  4P-2.0  [HW4-2.0]  178.56,140.21 270 top
J8  4P-2.0  [HW4-2.0]  57.4,113.54 180 top
J9  4P-2.0-90D  [HW4-2.0-90D]  236.42,229.62 270 bottom
J10  4P-2.0  [HW4-2.0]  60.96,92.2 90 top
J11  4P-2.0  [HW4-2.0]  198.63,32.26 180 top
J12  4P-2.0  [HW4-2.0]  210.57,32.26 180 top
J13  4P-2.0  [HW4-2.0]  90.42,126.24 180 top
J14  4P-2.0  [HW4-2.0]  104.39,126.24 180 top
J15  4P-2.0  [HW4-2.0]  117.86,127.25 180 top
J16  4P-2.0  [HW4-2.0]  166.62,22.86 270 top
J17  4P-2.0  [HW4-2.0]  24.64,113.28 180 top
J18  4P-2.0  [HW4-2.0]  41.66,124.46 180 top
J19  4P-2.0  [HW4-2.0]  29.46,124.46 180 top
J20  4P-2.0  [HW4-2.0]  10.41,24.64 90 top
J21  4P-2.0  [HW4-2.0]  8.13,15.75 0 top
J22  4P-2.0  [HW4-2.0]  3.56,24.64 90 top
J23  4P-2.0  [HW4-2.0]  19.05,15.75 0 top
J24  4P-2.0  [HW4-2.0]  28.7,16.76 270 top
J25  4P-2.0-90D  [HW4-2.0-90D]  217.88,229.36 270 bottom
J26  4P-2.0  [HW4-2.0]  35.56,16.76 270 top
J27  4P-2.0-90D  [HW4-2.0-90D]  217.63,204.98 270 bottom
J28  PJ-066A  [CUI_PJ-066A]  41.66,169.16 90 bottom
J29  4P-2.0-90D  [HW4-2.0-90D]  236.93,204.98 270 bottom
J31  4P-2.0-90D  [HW4-2.0-90D]  218.14,180.34 270 bottom
J32  AUDIO_JACK_TRS_0.25"_PTH_RA  [AUDIO_JACK_0.25"_TRS_PTH_RA]  261.87,87.12 270 top
J33  4P-2.0-90D  [HW4-2.0-90D]  236.93,180.34 270 bottom
J34  4P-2.0  [HW4-2.0]  14.48,153.67 0 top
J35  4P-2.0-90D  [HW4-2.0-90D]  255.73,180.59 270 bottom
J36  4P-2.0  [HW4-2.0]  100.84,114.81 0 top
J37  4P-2.0-90D  [HW4-2.0-90D]  255.22,205.23 270 bottom
J38  4P-2.0  [HW4-2.0]  246.89,62.99 180 top
J39  4P-2.0-90D  [HW4-2.0-90D]  264.11,18.8 270 bottom
J41  4P-2.0-90D  [HW4-2.0-90D]  263.6,43.43 270 bottom
J42  J-20-100-2X10_M  [DIL-100-2X10_M]  246.89,24.13 270 bottom
JP1  PINHD-2X8  [2X08]  120.4,176.02 0 bottom
JP2  PINHD-2X8  [2X08]  25.91,57.4 0 top
JP3  PINHD-2X4  [2X04]  81.79,71.63 90 top
JP4  PINHD-2X4  [2X04]  162.81,71.88 90 top
JP5  PINHD-2X4  [2X04]  199.39,133.6 90 top
JP6  PINHD-2X10  [2X10]  147.83,71.63 90 top
JP7  PINHD-2X10  [2X10]  228.85,71.88 90 top
JP8  PINHD-2X10  [2X10]  265.43,133.6 90 top
JP9  [2X15]  123.67,49.99 0 top
JP10  [2X15]  204.67,50.27 0 top
JP11  [2X15]  241.22,111.99 0 top
JP12  PINHD-1X2  [1X02]  76.2,23.11 90 top
JP13  PINHD-1X2  [1X02]  87.63,23.11 90 top
JP14  PINHD-1X2  [1X02]  90.68,113.79 0 top
JP17  PINHD-1X2  [1X02]  134.62,23.11 90 top
JP18  PINHD-1X2  [1X02]  99.06,23.11 90 top
JP19  PINHD-1X8  [1X08]  60.71,171.2 0 bottom
JP20  PINHD-1X2  [1X02]  25.91,153.92 90 top
JP21  PINHD-1X4  [1X04]  54.04,227.07 0 top
LED1  RED  [CHIP-LED0603]  24.89,109.47 270 top
LED2  GREEN  [CHIP-LED0603]  36.83,114.55 90 top
LED3  RED  [CHIP-LED0603]  228.6,35.56 270 top
LED4  RED  [CHIP-LED0603]  97.03,130.81 90 top
LED5  [P-LCC-2]  81.28,205.23 90 top
LED6  [P-LCC-2]  120.65,202.95 0 top
LED7  [P-LCC-2]  124.46,213.87 0 top
LED8  [P-LCC-2]  139.45,207.52 90 top
LED9  [P-LCC-2]  155.96,215.39 90 top
LED10  [P-LCC-2]  174.5,220.47 90 top
LED11  [P-LCC-2]  194.56,219.2 90 top
LED12  [P-LCC-2]  60.79,234.89 0 top
OPT1_A  PINHD-1X1  [1X01']  9.14,55.37 0 top
OPT1_B  PINHD-1X1  [1X01']  13.97,71.12 0 top
OPT2_A  PINHD-1X1  [1X01']  9.14,57.91 0 top
OPT2_B  PINHD-1X1  [1X01']  3.81,70.1 0 top
OPT3_A  PINHD-1X1  [1X01']  14.48,61.21 0 top
OPT3_B  PINHD-1X1  [1X01']  25.65,71.63 0 top
OPT4_A  PINHD-1X1  [1X01']  17.02,61.21 0 top
OPT4_B  PINHD-1X1  [1X01']  13.97,68.58 0 top
OPT5_A  PINHD-1X1  [1X01']  24.64,61.72 0 top
OPT5_B  PINHD-1X1  [1X01']  36.32,69.85 0 top
OPT6_A  PINHD-1X1  [1X01']  27.18,61.72 0 top
OPT6_B  PINHD-1X1  [1X01']  27.94,70.36 0 top
OPT7_A  PINHD-1X1  [1X01']  41.66,56.13 0 top
OPT7_B  PINHD-1X1  [1X01']  47.24,70.1 0 top
OPT8_A  PINHD-1X1  [1X01']  44.2,56.13 0 top
OPT8_B  PINHD-1X1  [1X01']  39.12,72.9 0 top
OPT9_A  PINHD-1X1  [1X01']  48.77,56.13 0 top
OPT9_B  PINHD-1X1  [1X01']  59.69,74.93 0 top
OPT10_A  PINHD-1X1  [1X01']  51.31,56.13 0 top
OPT10_B  PINHD-1X1  [1X01']  51.82,76.71 0 top
OPT11_A  PINHD-1X1  [1X01']  56.9,56.13 0 top
OPT11_B  PINHD-1X1  [1X01']  70.87,79.76 0 top
OPT12_A  PINHD-1X1  [1X01']  59.69,56.13 0 top
OPT12_B  PINHD-1X1  [1X01']  62.74,80.01 0 top
P1  P-10-100-2X05_M  [DIL-100-2X05_M]  77.72,152.4 180 bottom
P2  P-24-100-2X12_M  [DIL-100-2X12_M]  124.77,161.44 180 bottom
P3  M-1X03-SIP-100-40Y  [SIP-100-03-40Y]  16.51,130.56 90 top
P4  M-1X03-SIP-100-40Y  [SIP-100-03-40Y]  16.76,142.49 90 top
P5_2  [1X01]  206.5,27.69 180 top
P5_3  [1X01]  203.96,27.69 180 top
PA0  PINHD-1X1  [1X01']  13.97,73.66 0 top
PA1  PINHD-1X1  [1X01']  4.06,75.69 0 top
PA2  PINHD-1X1  [1X01']  25.65,74.17 0 top
PA3  PINHD-1X1  [1X01']  13.97,76.2 0 top
PA4  PINHD-1X1  [1X01']  36.07,75.44 0 top
PA5  PINHD-1X1  [1X01']  27.94,76.45 0 top
PA6  PINHD-1X1  [1X01']  47.24,75.69 0 top
PA7  PINHD-1X1  [1X01']  37.59,78.99 0 top
PB0  PINHD-1X1  [1X01']  59.18,84.07 0 top
PB1  PINHD-1X1  [1X01']  61.47,82.55 0 top
PC4  PINHD-1X1  [1X01']  59.18,80.77 0 top
PC5  PINHD-1X1  [1X01']  51.82,78.74 0 top
PGO1  [1X01]  215.6,235.71 0 top
PGO3  [1X01]  234.14,235.97 0 top
PGO5  [1X01]  215.34,211.33 0 top
PGO7  [1X01]  234.65,211.33 0 top
PGO9  [1X01]  215.85,186.69 0 top
PGO11  [1X01]  234.65,186.69 0 top
PGO13  [1X01]  253.44,186.94 0 top
PGO15  [1X01]  252.93,211.58 0 top
PGO17  [1X01]  261.82,25.15 0 top
PGO19  [1X01]  261.32,49.78 0 top
Q1  25MHz  [NX3225]  26.16,96.01 180 top
R1  10k  [RESC1608X60]  201.68,186.44 90 top
R2  100R  [RESC1608X60]  194.82,182.88 270 top
R3  10k  [RESC1608X60]  193.29,186.44 90 top
R4  47R  [R0603]  27.18,88.65 180 top
R5  10k  [R0603]  35.38,111.79 90 top
R6  100R  [RESC1608X60]  185.93,182.88 270 top
R7  10k  [RESC1608X60]  184.91,186.44 90 top
R8  100R  [RESC1608X60]  177.55,182.88 270 top
R9  560R  [R0603]  198.12,123.95 90 top
R10  560R  [R0603]  90.68,107.7 90 top
R11  47k  [R0603]  93.73,108.2 180 top
R12  10k  [RESC1608X60]  176.28,186.44 90 top
R13  560R  [R0603]  155.96,68.07 0 top
R14  0R_DNP  [R0603]  121.41,100.33 270 top
R15  0R_DNP  [R0603]  124.21,100.33 270 top
R16  100R  [RESC1608X60]  168.15,182.88 270 top
R17  10k  [RESC1608X60]  167.39,186.69 90 top
R18  100R  [RESC1608X60]  159.51,182.63 270 top
R19  10k  [RESC1608X60]  158.75,186.44 90 top
R20  100R  [RESC1608X60]  150.88,182.37 270 top
R21  10k  [RESC1608X60]  150.11,186.44 90 top
R22  100R  [RESC1608X60]  142.24,182.37 270 top
R23  10k  [RESC1608X60]  106.17,186.18 90 top
R24  100R  [RESC1608X60]  100.58,180.34 270 top
R25  10k  [RESC1608X60]  141.22,186.18 90 top
R26  100R  [RESC1608X60]  133.1,182.88 270 top
R27  10k  [RESC1608X60]  132.59,186.18 90 top
R28  100R  [RESC1608X60]  124.46,182.88 270 top
R29  10k  [RESC1608X60]  123.7,186.44 90 top
R30  100R  [RESC1608X60]  116.59,183.9 270 top
R31  10k  [RESC1608X60]  114.81,186.18 90 top
R32  100R  [RESC1608X60]  106.93,182.88 270 top
R33  20k  [R0603]  7.37,61.98 180 top
R34  20k  [R0603]  6.1,67.31 90 top
R35  820R  [R0603]  8.38,64.01 180 top
R36  820R  [R0603]  11.18,65.79 90 top
R37  0R  [R0603]  11.68,72.64 270 top
R38  20k  [R0603]  9.4,77.72 270 top
R39  20k  [R0603]  9.91,81.79 0 top
R40  820R  [R0603]  11.68,77.72 270 top
R41  820R  [R0603]  6.1,80.26 0 top
R42  0R  [R0603]  4.32,72.9 270 top
R43  100k  [R0603]  5.59,92.2 90 top
R44  100k  [R0603]  5.59,88.65 90 top
R45  20k  [R0603]  16.26,64.77 0 top
R46  20k  [R0603]  21.59,62.99 180 top
R47  820R  [R0603]  16.51,67.56 90 top
R48  820R  [R0603]  22.35,67.82 270 top
R49  0R  [R0603]  23.37,72.64 270 top
R50  20k  [R0603]  17.53,80.01 0 top
R51  20k  [R0603]  21.59,81.03 180 top
R52  820R  [R0603]  22.1,77.98 270 top
R53  820R  [R0603]  24.64,77.22 270 top
R54  0R  [R0603]  16.26,72.64 270 top
R55  20k  [R0603]  28.96,67.56 90 top
R56  20k  [R0603]  33.78,67.31 90 top
R57  820R  [R0603]  26.67,67.56 90 top
R58  820R  [R0603]  30.48,62.99 0 top
R59  0R  [R0603]  35.56,72.64 270 top
R60  20k  [R0603]  35.05,62.99 0 top
R61  20k  [R0603]  33.78,78.23 270 top
R62  33R  [R0201]  27.94,106.93 0 top
R63  820R  [R0603]  31.5,81.28 0 top
R64  820R  [R0603]  28.96,78.99 90 top
R65  0R  [R0603]  28.19,73.41 270 top
R66  20k  [R0603]  42.16,63.25 0 top
R67  20k  [R0603]  41.4,66.29 90 top
R68  820R  [R0603]  46.99,65.79 180 top
R69  820R  [R0603]  46.74,67.82 0 top
R70  0R  [R0603]  46.48,72.9 270 top
R71  20k  [R0603]  48.26,63.75 0 top
R72  20k  [R0603]  44.7,78.49 270 top
R73  820R  [R0603]  46.99,78.49 270 top
R74  820R  [R0603]  41.15,78.23 90 top
R75  0R  [R0603]  38.86,75.69 270 top
R76  20k  [R0603]  51.82,60.71 0 top
R77  20k  [R0603]  57.66,63.75 180 top
R78  820R  [R0603]  52.32,67.56 90 top
R79  560R  [R0603]  37.59,111.76 90 top
R80  820R  [R0603]  52.32,64.26 90 top
R81  33R  [R0201]  27.94,104.9 0 top
R82  0R  [R0603]  24.38,105.66 180 top
R83  33R  [R0201]  27.94,105.92 0 top
R84  33R  [R0201]  27.94,103.89 0 top
R85  0R  [R0603]  59.69,77.72 270 top
R86  0R_DNP  [R0603]  24.38,103.63 180 top
R87  0R_DNP  [R0603]  24.38,107.7 180 top
R88  20k  [R0603]  56.9,60.96 0 top
R89  20k  [R0603]  57.4,78.23 270 top
R90  820R  [R0603]  51.31,71.88 0 top
R91  820R  [R0603]  49.53,75.69 270 top
R92  0R  [R0603]  53.85,77.98 270 top
R93  20k  [R0603]  62.48,65.02 0 top
R94  20k  [R0603]  65.53,67.56 90 top
R95  820R  [R0603]  65.53,63.75 90 top
R96  820R  [R0603]  68.58,62.74 0 top
R97  0R  [R0603]  70.87,82.55 270 top
R98  20k  [R0603]  66.55,59.69 0 top
R99  20k  [R0603]  61.98,72.39 270 top
R100  820R  [R0603]  69.02,78.41 270 top
R101  820R  [R0603]  65.53,78.49 90 top
R102  0R  [R0603]  64.26,84.07 0 top
R103  0R  [R0603]  15.24,98.81 270 top
R104  560R  [R0603]  20.83,109.47 0 top
R105  33R  [R0402]  40.64,114.05 90 top
R106  33R  [R0402]  41.91,114.05 90 top
R107  33R  [R0402]  44.45,113.28 270 top
R108  0R_DNP  [R0603]  25.65,101.6 180 top
R109  33R  [R0402]  43.18,113.28 90 top
R110  0R  [R0603]  119.13,100.33 270 top
R111  0R  [R0603]  126.49,100.33 270 top
R113  10k  [R0603]  234.95,15.49 270 top
R114  10k  [R0603]  238.76,18.8 270 top
R115  10k  [R0603]  219.46,15.49 0 top
R116  0R  [R0603]  200.41,23.11 180 top
R117  33R  [R0201]  219.71,35.56 0 top
R118  33R  [R0201]  219.71,34.54 0 top
R119  33R  [R0201]  216.92,30.48 0 top
R120  10k  [R0603]  219.71,13.21 180 top
R121  33R  [R0201]  216.92,29.46 0 top
R122  33R  [R0201]  216.92,28.8 0 top
R123  560R  [R0603]  225.81,35.56 0 top
R124  33R  [R0201]  217.04,27.56 0 top
R125  1k  [R0603]  19.84,28.96 180 top
R126  2k  [R0603]  218.64,236.98 0 top
R127  2k  [R0603]  218.64,234.19 180 top
R128  560R  [R0603]  87.12,199.39 270 top
R129  560R  [R0603]  121.16,197.1 0 top
R130  0R  [R0603]  62.93,149.28 90 top
R131  2k  [R0603]  219.66,231.65 270 top
R132  0R_DNP  [R0603]  212.8,235.71 180 top
R133  0R  [R0603]  10.16,33.27 0 top
R134  1k  [R0603]  15.24,28.96 0 top
R135  560R  [R0603]  128.27,210.06 270 top
R136  560R  [R0603]  142.75,211.33 0 top
R137  560R  [R0603]  159,219.46 0 top
R138  560R  [R0603]  100.08,130.81 180 top
R139  560R  [R0603]  177.8,224.03 0 top
R140  560R  [R0603]  197.1,223.27 90 top
R141  560R  [R0603]  56.55,229.79 180 top
R142  1.5k  [R0603]  141.73,159.77 0 top
R143  0R  [R0603]  75.95,228.09 0 top
R144  0R  [R0603]  75.95,223.01 0 top
R145  0R_DNP  [R0603]  75.95,220.22 180 top
R146  0R_DNP  [R0603]  75.95,225.55 180 top
R147  1.5k  [R0603]  141.73,162.56 0 top
R148  1.5k  [R0603]  85.34,158.24 180 top
R149  1.5k  [R0603]  84.84,161.29 270 top
R150  1.5k  [R0603]  30.73,29.21 180 top
R151  1.5k  [R0603]  39.12,20.32 270 top
R152  1.5k  [R0603]  86.61,167.13 90 top
R153  1.5k  [R0603]  88.9,163.83 0 top
R154  1.5k  [R0603]  75.44,166.88 180 top
R155  1.5k  [R0603]  74.68,169.42 180 top
R156  1.5k  [R0603]  54.36,166.88 90 top
R157  1.5k  [R0603]  54.36,163.32 90 top
R158  1k  [R0603]  145.54,139.95 270 top
R159  1k  [R0603]  104.65,106.68 0 top
R160  1k  [R0603]  104.14,109.22 270 top
R161  1k  [R0603]  106.17,109.22 270 top
R162  1k  [R0603]  108.2,109.22 270 top
R163  2k  [R0603]  237.19,237.24 0 top
R164  2k  [R0603]  237.19,234.44 180 top
R165  2k  [R0603]  238.2,231.9 270 top
R166  0R_DNP  [R0603]  231.34,235.97 180 top
R167  1k  [R0603]  98.81,108.97 270 top
R168  1k  [R0603]  96.77,108.97 270 top
R169  1k  [R0603]  98.3,106.43 180 top
R170  1k  [R0603]  103.63,94.74 90 top
R171  2k  [R0603]  218.39,212.6 0 top
R172  2k  [R0603]  218.39,209.8 180 top
R173  2k  [R0603]  219.41,207.26 270 top
R174  0R_DNP  [R0603]  212.55,211.33 180 top
R175  1k  [R0603]  105.92,94.74 90 top
R176  1k  [R0603]  105.16,97.54 0 top
R177  1k  [R0603]  99.82,94.74 90 top
R178  1k  [R0603]  97.54,94.74 90 top
R179  2k  [R0603]  237.69,212.6 0 top
R180  2k  [R0603]  237.69,209.8 180 top
R181  2k  [R0603]  238.71,207.26 270 top
R182  0R_DNP  [R0603]  231.85,211.33 180 top
R183  1k  [R0603]  98.81,97.54 180 top
R184  560R  [R0603]  80.52,62.23 90 top
R185  0R  [R0603]  119.63,94.74 180 top
R186  2k  [R0603]  249.38,72.34 270 top
R187  2k  [R0603]  218.9,187.96 0 top
R188  2k  [R0603]  218.9,185.17 180 top
R189  2k  [R0603]  219.91,182.63 270 top
R190  0R_DNP  [R0603]  213.06,186.69 180 top
R191  2k  [R0603]  248.97,68.72 180 top
R192  10k  [R0603]  245.62,80.77 270 top
R193  10k  [R0603]  245.62,76.96 90 top
R194  10k  [R0603]  250.19,80.77 90 top
R195  2k  [R0603]  237.69,187.96 0 top
R196  2k  [R0603]  237.69,185.17 180 top
R197  2k  [R0603]  238.71,182.63 270 top
R198  0R_DNP  [R0603]  231.85,186.69 180 top
R199  10k  [R0603]  246.13,83.57 0 top
R200  33R  [R0201]  123.95,132.08 180 top
R201  33R  [R0201]  114.3,131.32 180 top
R202  33R  [R0201]  48.51,110.49 270 top
R203  2k  [R0603]  256.49,188.21 0 top
R204  2k  [R0603]  256.49,185.42 180 top
R205  2k  [R0603]  257.51,182.88 270 top
R206  0R_DNP  [R0603]  250.65,186.94 180 top
R207  33R  [R0201]  114.3,130.56 180 top
R211  2k  [R0603]  255.98,212.85 0 top
R212  2k  [R0603]  255.98,210.06 180 top
R213  2k  [R0603]  257,207.52 270 top
R214  0R_DNP  [R0603]  250.14,211.58 180 top
R219  2k  [R0603]  264.87,26.42 0 top
R220  2k  [R0603]  264.87,23.62 180 top
R221  2k  [R0603]  265.89,21.08 270 top
R222  0R_DNP  [R0603]  259.03,25.15 180 top
R227  2k  [R0603]  264.36,51.05 0 top
R228  2k  [R0603]  264.36,48.26 180 top
R229  2k  [R0603]  265.38,45.72 270 top
R230  0R_DNP  [R0603]  258.52,49.78 180 top
S1  MOMENTARY-SWITCH-SPST-PTH-6.0MM  [TACTILE_SWITCH_PTH_6.0MM]  139.67,200.58 0 top
S2  MOMENTARY-SWITCH-SPST-PTH-6.0MM  [TACTILE_SWITCH_PTH_6.0MM]  155.85,208.56 0 top
S3  MOMENTARY-SWITCH-SPST-PTH-6.0MM  [TACTILE_SWITCH_PTH_6.0MM]  174.29,213.59 0 top
S4  MOMENTARY-SWITCH-SPST-PTH-6.0MM  [TACTILE_SWITCH_PTH_6.0MM]  194.59,212.65 0 top
S5  MOMENTARY-SWITCH-SPST-PTH-6.0MM  [TACTILE_SWITCH_PTH_6.0MM]  89.18,226.06 0 top
S6  MOMENTARY-SWITCH-SPST-PTH-6.0MM  [TACTILE_SWITCH_PTH_6.0MM]  88.9,211.23 0 top
S7  MOMENTARY-SWITCH-SPST-PTH-6.0MM  [TACTILE_SWITCH_PTH_6.0MM]  94.64,218.57 0 top
S8  MOMENTARY-SWITCH-SPST-PTH-6.0MM  [TACTILE_SWITCH_PTH_6.0MM]  83.74,218.62 0 top
S9  MOMENTARY-SWITCH-SPST-PTH-6.0MM  [TACTILE_SWITCH_PTH_6.0MM]  81.18,199.26 0 top
S10  MOMENTARY-SWITCH-SPST-PTH-6.0MM  [TACTILE_SWITCH_PTH_6.0MM]  113.61,202.74 0 top
S11  MOMENTARY-SWITCH-SPST-PTH-6.0MM  [TACTILE_SWITCH_PTH_6.0MM]  117.58,213.89 0 top
S12  MOMENTARY-SWITCH-SPST-PTH-6.0MM  [TACTILE_SWITCH_PTH_6.0MM]  53.07,234.71 0 top
SW1  PEC11R-4215F-S0024  [PEC11R-4215F-S0024]  109.47,233.43 0 top
U1  CY8C5868AXI-LP035  [TQFP-100-14X14MM]  226.82,25.65 270 top
U2  CY8C5868AXI-LP035  [TQFP-100-14X14MM]  108.71,142.75 0 top
U3  [QRE1113]  198.37,184.66 0 top
U4  [QRE1113]  189.74,184.66 0 top
U5  [QRE1113]  181.1,184.66 0 top
U6  [QRE1113]  172.21,184.66 0 top
U7  [QRE1113]  163.58,184.66 0 top
U8  [QRE1113]  154.69,184.66 0 top
U9  [QRE1113]  146.05,184.66 0 top
U10  [QRE1113]  137.16,184.66 0 top
U11  [QRE1113]  128.52,184.66 0 top
U12  [QRE1113]  119.89,184.66 0 top
U13  [QRE1113]  111,184.4 0 top
U14  [QRE1113]  102.36,184.4 0 top
U15  R-78E5.0-1.0  [DC-DC_CONVERTER_78XX]  44.7,156.21 180 top
U16  TEXAS_TPS2051B  [TEXAS_SOT23-5]  110.24,180.09 270 top
U17  R-78E5.0-1.0  [DC-DC_CONVERTER_78XX]  162.81,106.17 90 top
U19  TCA9548APWR  [SOP65P640X120-24N]  140.21,143.51 180 top
U20  TCA9548APWR  [SOP65P640X120-24N]  20.07,23.62 0 top
U22  AS5600  [SOIC8-1.27-5X4MM]  213.82,229.62 0 top
U23  AS5600  [SOIC8-1.27-5X4MM]  232.36,229.87 0 top
U25  AS5600  [SOIC8-1.27-5X4MM]  213.56,205.23 0 top
U27  AS5600  [SOIC8-1.27-5X4MM]  232.87,205.23 0 top
U29  AS5600  [SOIC8-1.27-5X4MM]  214.07,180.59 0 top
U31  AS5600  [SOIC8-1.27-5X4MM]  232.87,180.59 0 top
U33  AS5600  [SOIC8-1.27-5X4MM]  251.66,180.85 0 top
U35  AS5600  [SOIC8-1.27-5X4MM]  251.16,205.49 0 top
U37  AS5600  [SOIC8-1.27-5X4MM]  260.05,19.05 0 top
U39  AS5600  [SOIC8-1.27-5X4MM]  259.54,43.69 0 top
U$1  RK09  [RK09]  152.15,233.17 0 top
U$2  RK09  [RK09]  189.23,233.68 0 top
U$3  CMR0512S3C  [CMR0512S3C]  128.78,110.74 0 top
U$5  MCP3221  [SOT23-5L]  244.83,70.01 270 top
U$6  SS-7188VS-A-FLS  [SS-7188VS-A-FLS_RJ45]  20.57,38.86 180 bottom
U$9  P82B96DP,118  [SO8]  81.03,165.61 270 top
U$10  P82B96DP,118  [SO8]  34.54,25.65 270 top
VREGGND  PINHD-1X1  [1X01']  123.95,103.12 90 top
VREGIN  PINHD-1X1  [1X01']  121.41,103.12 90 top
X1  3221-10-0300-00  [3221-10-0300-00]  81.28,138.94 270 top
X2  3221-10-0300-00  [3221-10-0300-00]  68.58,100.84 90 top
X3  3221-10-0300-00  [3221-10-0300-00]  177.8,33.02 180 top
X4  GLX-S-88M  [GLX-S-88M]  82.04,178.56 0 bottom
X5  2524-  [PAK100/2500-24]  82.55,234.51 0 bottom
X6  2520-  [PAK100/2500-20]  96.77,4.83 0 top
X7  2516-  [PAK100/2500-16]  181.61,104.14 0 top
X8  2510-  [PAK100/2500-10]  129.59,225.46 0 bottom
X9  2516-  [PAK100/2500-16]  138.94,128.78 0 top

## Tracks (layer width: path | path; a pad name or v marks a point on that pad's centre or on a via)
3V3  (via drill 0.35)
  Top 0.305: C99.1 IC7.4 32,72.14 v31.1,73.04 | C101.1 42.93,68.47 IC8.4 v42.93,71.63 | C103.1 IC9.4 v55.63,71.63 | C105.1 IC10.4 v67.31,71.37 | C41.1 IC1.4 19.81,70.99 19.69,71.12 v19.69,71.37 | C45.1 IC17.4 v8.13,71.12
  Top 0.61: R43.2 5.79,92.85 | C43.1 7.73,92.28 IC4.5 7.43,92.64 7.11,92.96 7,92.85
  Top 0.813: 7,92.85 7,93.22 5.59,93.22 | 5.59,93.22 R43.2 | C31.1 3.95,92.85 4.32,93.22 5.59,93.22
  Top 1.27: IC4.5 7.43,92.49 6.86,93.07 6.86,93.73 v6.35,94.23
  Route15 0.305: 66.93,70.99 v67.31,71.37 | 42.93,71.12 v42.93,71.63 | 19.81,70.61 19.69,70.74 v19.69,71.37
  Route15 0.508: 35.56,72.39 32.97,72.39 32.87,72.29 31.85,72.29 v31.1,73.04
  Route15 1.27: v6.35,94.23 3.56,91.44 3.56,77.98 2.29,76.71 2.29,74.42 5.11,71.6 5.11,71.37 5.84,70.64 6.07,70.64 6.6,70.1 6.6,69.85 7.11,69.85 8.38,71.12 9.93,69.57 9.93,68.07 11.45,66.55 15.75,66.55 19.81,70.61 23.62,70.61 27.43,66.8 27.43,64.77 32.26,59.94 JP2.14 | 35.56,72.39 36.08,72.39 37.35,71.12 42.93,71.12 46.23,67.82 50.04,67.82 53.85,71.63 v55.63,71.63 55.65,71.6 55.65,71.37 56.92,70.1 66.04,70.1 66.93,70.99
  pour Route15 (isolate 0.813): 0,99.31 16.76,99.31 16.76,92.2 37.34,92.2 41.15,88.39 41.15,84.84 44.7,81.28 53.59,81.28 57.91,85.6 71.37,85.6 73.66,83.31 73.66,52.83 0.51,52.83 0,53.34
3V3A
  Top 0.254: C65.1 29.18,90.42 29.55,90.79 IC3.33 | C116.1 11.18,97.79 10.92,97.54
  Top 0.406: IC11.1 11.63,97.67 11.06,97.67 10.92,97.54 10.87,97.59 C113.1
  Top 0.61: R4.1 28.03,90.39 C65.1 28.06,88.25 26.67,86.87 26.16,86.87
  Top 0.813: C113.1 9.65,97.03
  Top 1.016: C110.1 8.29,97.03 9.65,97.03 10.92,97.03 | 26.16,86.87 24.38,86.87 22.1,89.15 21.84,89.15
  Top 1.27: C110.1 7.62,96.69 7.62,96.52 5.97,96.52 C111.1 2.89,96.64 C112.+ | 12.19,95.25 3V3A.1
  Top 1.905: 3V3A.1 10.92,97.03
  Top 2.54: 12.19,95.25 12.19,93.47 13.21,92.46 15.75,92.46 15.89,92.31 D3.A 19.56,91.44 21.84,89.15
3V3A2  (via drill 0.65)
  Top 0.254: C124.1 229.22,15.37 228.84,15.75 | U1.65 227.83,17.64 227.83,16.76 228.84,15.75 | 228.84,15.75 v230.63,15.75
  Top 1.016: C124.1 230.63,13.57 230.63,12.72 C125.1 | IC18.2 204.85,16 206.87,16 C152.1 207.63,16.49 C153.1 214.15,16.49 215.39,15.24 3V3A_2.1
  Top 1.27: 201.42,16 204.85,16 | 209.04,17.78 209.04,16.74 C153.1
  Top 2.54: IC18.PAD 198.53,17.12 198.37,17.27 201.42,17.27 201.42,16 | 208.79,17.78 209.04,17.78
  pour Route15 (isolate 0.508, no thermals): 193.8,10.92 194.06,11.18 194.06,16.51 201.68,24.13 220.22,24.13 222.5,21.84 243.33,21.84 243.33,36.32 249.94,36.32 249.94,10.92
3V3A4  (via drill 0.35)
  Top 0.254: C137.1 120.65,146.3 119.52,145.18 C136.1 119.39,144.27 118.88,143.76 116.72,143.76 U2.65 115.32,143.75 115.06,143.49 115.06,143 v114.05,141.99
  Top 1.27: 57.09,137.34 57.85,137.34 58.13,137.62 IC14.2 58.13,146.05 IC14.PAD 59.12,145.06 59.12,143.43 59.63,142.93 3V3A_1.1 | 57.09,137.34 C134.1 | 57.09,137.34 57.09,134.52 C135.1 57.07,134.54 57.07,130.68 57.06,130.72 55.63,129.29 40.89,129.29 30.23,139.95 P4.1 20.57,139.95 21.08,139.45 21.08,130.05 19.05,128.02 P3.1
  Bottom 0.813: v114.05,141.99 109.73,141.99 108.2,143.51 92.96,143.51 91.19,145.29 83.06,145.29 79.63,148.72
  Bottom 1.016: 3V3A_1.1 73.84,142.93 79.63,148.72 80.26,149.35 P1.7
3V3D2  (via drill 0.65)
  Top 0.254: U1.75 234.71,17.65 C133.1 234.61,17.87 v233.68,18.8 | U1.88 236.39,25.65 C154.1 236.84,26.53 237.51,27.2 v237.51,27.46 | C150.1 234.82,33.26 U1.100 234.73,31.75 233.17,31.75 v232.92,31.5 | U1.26 218.82,31.75 C148.1 | C151.1 217.42,26.67 217.92,26.16 218.81,26.16 U1.37 220.48,26.15 v220.73,25.91 | C149.1 218.55,19.38 U1.50 218.73,19.56 216.66,19.56 216.62,19.6 v214.88,19.6
  Top 0.813: v182.37,34.8 180.43,34.8 X3.1 | C148.1 218.45,32.79 218.58,33.16 218.72,33.02 v219.71,33.02
  Top 1.016: IC20.PAD 189.64,13.87 3V3D2.1 | IC20.2 185.65,22.19 C157.1 185.31,22.35 185.17,22.49 185.17,24.61 C161.1
  Top 1.27: C161.1 184.4,23.85 184.4,23.11 183.39,23.11 v183.39,22.86
  Top 2.54: IC20.PAD 183.49,13.87 181.1,16.26 181.1,17.02 169.93,17.02 172.47,14.48 | 182.88,14.73 191.77,14.73 191.77,12.45 191.53,12.2 170.95,12.2 172.85,14.1 172.47,14.48 | 172.47,14.48 181.61,14.48
  Route15 0.254: v214.88,19.6 214.88,25.4 215.14,25.65
  Route15 0.813: v233.68,18.8 233.68,23.11 233.43,23.37
  Route15 1.27: v183.39,22.86 184.4,22.86 186.44,20.83
  pour Route15 (isolate 0.508, no thermals): 160.78,37.59 242.57,37.59 242.57,22.86 222.76,22.86 220.47,25.15 201.42,25.15 193.04,16.76 193.04,11.68 192.53,11.18 161.8,11.18 160.78,12.19
3V3D3  (via drill 0.55)
  Top 0.152: IC15.PAD 30.89,31.54 30.85,31.5
  Top 0.305: R125.1 21.18,28.96 U20.24 24.48,27.2
  Top 0.406: R134.2 v17.53,28.96
  Top 0.61: R150.2 29.88,30.65 30.99,31.75 30.99,32.41 IC15.PAD | R151.2 39.12,16.51 38.37,15.76 J26.3
  Top 0.813: C162.1 24.41,27.27 C164.1 | C164.1 22.72,28.96 v22.61,28.96 | 24.48,27.2 24.89,27.2 C164.1
  Top 1.016: J22.3 5.83,25.64 6.6,26.42 6.33,26.69 C168.1 | C167.1 37.35,32.37 IC15.2
  Top 1.27: IC15.2 30.91,32.54 IC15.PAD | 30.85,31.5 v34.04,31.5
  pour Route15 (isolate 0.508): 0.25,31.5 6.18,28.96 27.69,28.96 30.51,31.78 35.28,31.78 37.08,29.97 39.37,10.67 0.25,10.67
3V3D5  (via drill 0.35, 0.55)
  Top 0.254: C142.1 108.2,152.14 108.7,151.65 U2.88 v108.71,148.59 | C144.1 117.09,149.13 U2.75 116.62,148.84 v114.81,148.84 | C141.1 115.58,134.75 U2.50 115.82,134.75 v115.82,135.64 | U2.37 108.21,133.2 C146.1 | U2.26 102.24,134.75 102.11,134.62 | U2.100 102.11,150.75 | 102.11,150.75 101.59,150.75 C143.1 | 102.11,150.75 101.6,150.24 101.6,149.86 v101.85,149.61 | R158.2 151.03,139.1 J3.3
  Top 0.406: U19.24 137.3,139.9 137.3,139.19 C165.1 138.06,137.3 137.3,136.53 C169.1
  Top 0.61: v114.81,148.84 114.06,148.84 111.77,146.56 v111,146.56
  Top 0.813: C165.1 v136.65,138.43 | X1.1 76.71,141.48 v76.2,141.99 | C145.1 101.85,134.37 102.11,134.62 101.85,134.62 101.35,135.13 v101.35,135.64 | C146.1 109.28,132.7 109.98,131.99 v109.98,131.57 | R147.2 142.58,161.04 | 142.58,161.04 R142.2 | 142.58,161.04 143.26,161.04 v143.51,161.29
  Top 1.016: R148.2 84.46,158.21 82.89,158.16 82.8,158.24 v82.55,158.24 | R149.2 88.56,160.44 v89.15,161.04
  Top 1.27: v50.55,134.11 50.55,134.37 49.88,134.37 C130.1 48.94,136.46 48.31,137.08 C128.1 47.72,137.17 47.72,139.52 IC13.2 47.44,139.8 IC13.PAD
  Bottom 0.152: v111,146.56 110.91,146.56
  Bottom 0.813: v108.71,148.59 108.71,147.07 109.22,146.56 110.91,146.56 110.95,146.6
  pour Route15 (isolate 0.508, rank 2): 49.02,122.94 49.02,137.67 52.32,134.37 52.32,132.84 63.75,132.84 68.83,137.92 68.83,151.64 75.95,158.75 86.11,158.75 93.98,166.62 159.26,166.62 161.04,164.85 161.54,164.85 182.12,144.27 182.12,127.25 177.8,122.94
5VD2
  Top 1.016: IC20.3 182.78,20.17 179.32,23.62 5VD2.1 177.57,23.85 C160.1 170.3,23.85 C156.1 170.05,23.86 J16.2 J16.1
  Top 1.27: IC20.3 183.36,18.06 184.15,17.27 191.77,17.27 194.82,20.32 202.82,20.32 IC18.3
5VD4  (via drill 0.35, 0.55)
  Top 0.254: R155.2 v72.64,169.42 | R154.2 74.59,165.95 75.01,165.53 v74.93,165.45 | R152.2 v86.61,169.42 | R153.2 89.75,165.19 v89.92,165.35
  Top 0.813: R152.2 84.92,167.98 84.58,167.64 83.95,168.28 | U$9.8 83.95,167.83 | 83.95,167.83 83.95,168.28 | 83.95,168.28 v83.69,168.53 83.31,168.91 C166.1 82.41,168.54 82.8,168.15 83.63,168.15 83.95,167.83
  Top 1.016: U15.VOUT 42.31,156.21 C127.1 42.19,158.87 42.19,156.21 41.66,157 C129.1
  Top 1.27: IC14.3 62.6,137.59 5VD1.1 | 52.01,137.59 v52.01,137.85 51.68,137.85 IC13.3 49.95,139.97 50,139.97 51.29,141.26
  Top 2.54: 51.29,141.26 51.29,147.84 49.78,149.35 44.2,149.35 42.16,151.38 U15.VOUT
  Route15 2.54: U15.VOUT 40.64,156.21
  pour Route15 (isolate 0.508, rank 2): 47.56,153.67 49.78,153.67 52.83,156.72 52.83,180.34 90.93,180.34 91.44,179.83 91.44,166.37 91.95,165.86 86.11,160.02 75.69,160.02 67.82,152.15 67.82,138.57 62.99,133.74 55.63,133.74 50.04,139.33 46.57,137.69 46.48,135.52 46.74,135.26 46.74,122.94 9.14,122.94 8.64,123.44 8.64,145.29 9.65,146.3 32,146.3 36.9,151.04 36.59,159.53 36.58,160.27 42.93,156.46 42.93,154.94 43.18,154.69 43.69,154.69 44.45,153.92 47.3,153.92
12VD2  (via drill 0.9)
  Top 2.54: C171.+ 47.75,155.7 U15.VIN 47.42,156.39 v47.42,159.26 47.42,164.05 D2.C
  Route15 2.54: U15.VIN 47.24,151.88 40.19,144.82 40.19,135.58 52.32,123.44 125.98,123.44 X9.1 X9.3
  pour Route15 (isolate 0.508): 36.47,180.09 45.97,180.09 50.84,175.22 51.08,156.68 50.01,155.61 47.97,155.61 36.41,162
+1.8V  (via drill 0.35)
  Top 0.254: C73.2 C100.1 32.2,79.08 R61.1 | v63.22,72.99 62.23,72.99 R99.1